# EAGLE schematic CC_Chompi_Rev4 (EAGLE 9.6.2)
Assembly variants: OG_AUDIO_BB

## Sheet 1 of 8: MCU, etc.
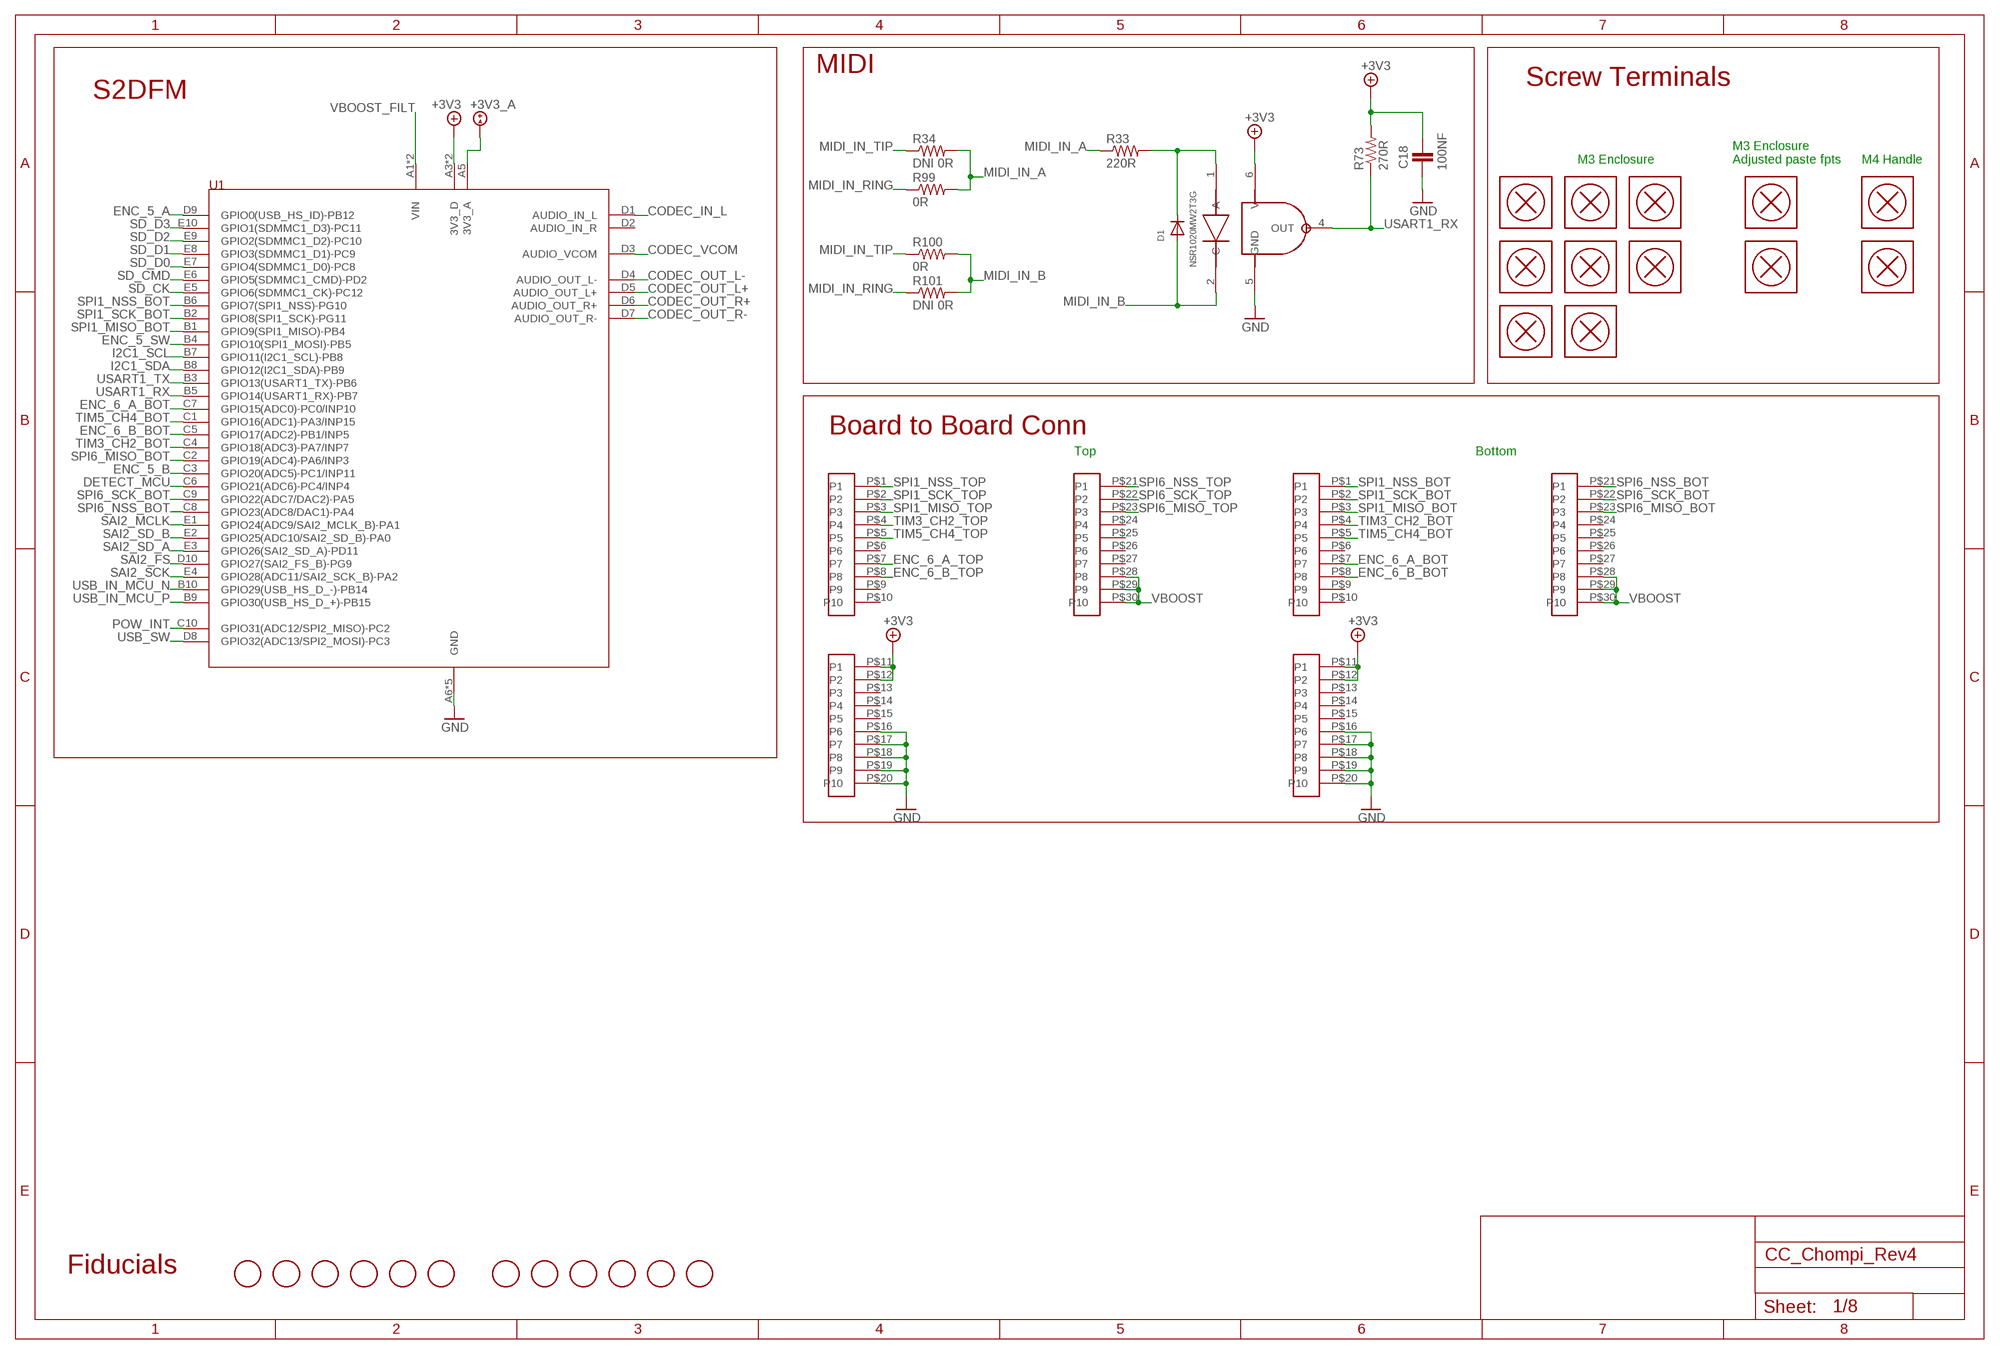
[diagram p0: schematic, sheet 1]

### Parts
C18  100NF  C-EUC0402  [C0402]
D1  NSR1020MW2T3G  DIODE_SOD-323F  [SOD-323F]
FD1  FIDUCIAL  [FIDUCIAL_1MM]
FD2  FIDUCIAL  [FIDUCIAL_1MM]
FD3  FIDUCIAL  [FIDUCIAL_1MM]
FD4  FIDUCIAL  [FIDUCIAL_1MM]
FD5  FIDUCIAL  [FIDUCIAL_1MM]
FD6  FIDUCIAL  [FIDUCIAL_1MM]
FD7  FIDUCIAL  [FIDUCIAL_1MM]
FD8  FIDUCIAL  [FIDUCIAL_1MM]
FD9  FIDUCIAL  [FIDUCIAL_1MM]
FD10  FIDUCIAL  [FIDUCIAL_1MM]
FD11  FIDUCIAL  [FIDUCIAL_1MM]
FD12  FIDUCIAL  [FIDUCIAL_1MM]
HANDLE_1  SCREW_TERMINALM4  [M4_SCREW_TERMINAL]
HANDLE_2  SCREW_TERMINALM4  [M4_SCREW_TERMINAL]
P2  ZIF-30  [FH34SRJ-30S-0-5SH-50]
P3  ZIF-30  [FH34SRJ-30S-0-5SH-50]
R33  220R  R-US_R0603  [R0603]
R34  DNI 0R  R-US_R0603  [R0603]
R73  270R  R-US_R0603  [R0603]
R99  0R  R-US_R0603  [R0603]
R100  0R  R-US_R0603  [R0603]
R101  DNI 0R  R-US_R0603  [R0603]
SCREW_1  SCREW_TERMINALM3_OLD  [T34069_OLD]
SCREW_2  SCREW_TERMINALM3_OLD  [T34069_OLD]
SCREW_3  SCREW_TERMINALM3_OLD  [T34069_OLD]
SCREW_4  SCREW_TERMINALM3_OLD  [T34069_OLD]
SCREW_5  SCREW_TERMINALM3_OLD  [T34069_OLD]
SCREW_6  SCREW_TERMINALM3_OLD_ADJ2  [T34069_OLD_ADJ2]
SCREW_7  SCREW_TERMINALM3_OLD  [T34069_OLD]
SCREW_8  SCREW_TERMINALM3_OLD_ADJ1  [T34069_OLD_ADJ1]
SCREW_9  SCREW_TERMINALM3_OLD  [T34069_OLD]
SCREW_10  SCREW_TERMINALM3_OLD  [T34069_OLD]
U1  ES_DAISY_SEED2_DFM_REV1""  [ES_DAISY_SEED2_DFM_REV1]
U6  OPTO ISOLATOR  OPTOISOLATOR_H11L1M  [DIL06_GULLWING]

### Nets
+3V3: C18.2 P2.P$11(P1) P2.P$12(P2) P3.P$11(P1) P3.P$12(P2) R73.2 U1.A3(3V3_D) U1.A4(3V3_D) U6.6(V) ; also sheet 2,3,6,7
+3V3_A: U1.A5(3V3_A) ; also sheet 3
CODEC_IN_L: U1.D1(AUDIO_IN_L) ; also sheet 8
CODEC_OUT_L+ [CODEC]: U1.D5(AUDIO_OUT_L+) ; also sheet 8
CODEC_OUT_L- [CODEC]: U1.D4(AUDIO_OUT_L-) ; also sheet 8
CODEC_OUT_R+ [CODEC]: U1.D6(AUDIO_OUT_R+) ; also sheet 8
CODEC_OUT_R- [CODEC]: U1.D7(AUDIO_OUT_R-) ; also sheet 8
CODEC_VCOM: U1.D3(AUDIO_VCOM) ; also sheet 8
DETECT_MCU: U1.C6(GPIO21(ADC6)-PC4/INP4) ; also sheet 3
ENC_5_A: U1.D9(GPIO0(USB_HS_ID)-PB12) ; also sheet 3
ENC_5_B: U1.C3(GPIO20(ADC5)-PC1/INP11) ; also sheet 3
ENC_5_SW: U1.B4(GPIO10(SPI1_MOSI)-PB5) ; also sheet 3
ENC_6_A_BOT: P3.P$7(P7) U1.C7(GPIO15(ADC0)-PC0/INP10)
ENC_6_A_TOP: P2.P$7(P7) ; also sheet 3
ENC_6_B_BOT: P3.P$8(P8) U1.C5(GPIO17(ADC2)-PB1/INP5)
ENC_6_B_TOP: P2.P$8(P8) ; also sheet 3
GND: C18.1 P2.P$16(P6) P2.P$17(P7) P2.P$18(P8) P2.P$19(P9) P2.P$20(P10) P3.P$16(P6) P3.P$17(P7) P3.P$18(P8) P3.P$19(P9) P3.P$20(P10) U1.A6(GND) U1.A7(GND) U1.A8(GND) U1.A9(GND) U1.A10(GND) U6.5(GND) ; also sheet 2,3,4,5,6,7,8
I2C1_SCL: U1.B7(GPIO11(I2C1_SCL)-PB8) ; also sheet 2
I2C1_SDA: U1.B8(GPIO12(I2C1_SDA)-PB9) ; also sheet 2
MIDI_IN_A: R33.1 R34.2 R99.2
MIDI_IN_B: D1.A R100.2 R101.2 U6.2(C)
MIDI_IN_RING: R99.1 R101.1 ; also sheet 3
MIDI_IN_TIP: R34.1 R100.1 ; also sheet 3
N$86: D1.C R33.2 U6.1(A)
POW_INT: U1.C10(GPIO31(ADC12/SPI2_MISO)-PC2) ; also sheet 2
SAI2_FS: U1.D10(GPIO27(SAI2_FS_B)-PG9) ; also sheet 7
SAI2_MCLK: U1.E1(GPIO24(ADC9/SAI2_MCLK_B)-PA1) ; also sheet 7
SAI2_SCK: U1.E4(GPIO28(ADC11/SAI2_SCK_B)-PA2) ; also sheet 7
SAI2_SD_A: U1.E3(GPIO26(SAI2_SD_A)-PD11) ; also sheet 7
SAI2_SD_B: U1.E2(GPIO25(ADC10/SAI2_SD_B)-PA0) ; also sheet 7
SD_CK: U1.E5(GPIO6(SDMMC1_CK)-PC12) ; also sheet 3
SD_CMD: U1.E6(GPIO5(SDMMC1_CMD)-PD2) ; also sheet 3
SD_D0: U1.E7(GPIO4(SDMMC1_D0)-PC8) ; also sheet 3
SD_D1: U1.E8(GPIO3(SDMMC1_D1)-PC9) ; also sheet 3
SD_D2: U1.E9(GPIO2(SDMMC1_D2)-PC10) ; also sheet 3
SD_D3: U1.E10(GPIO1(SDMMC1_D3)-PC11) ; also sheet 3
SPI1_MISO_BOT: P3.P$3(P3) U1.B1(GPIO9(SPI1_MISO)-PB4)
SPI1_MISO_TOP: P2.P$3(P3) ; also sheet 6
SPI1_NSS_BOT: P3.P$1(P1) U1.B6(GPIO7(SPI1_NSS)-PG10)
SPI1_NSS_TOP: P2.P$1(P1) ; also sheet 6
SPI1_SCK_BOT: P3.P$2(P2) U1.B2(GPIO8(SPI1_SCK)-PG11)
SPI1_SCK_TOP: P2.P$2(P2) ; also sheet 6
SPI6_MISO_BOT: P3.P$23(P3) U1.C2(GPIO19(ADC4)-PA6/INP3)
SPI6_MISO_TOP: P2.P$23(P3) ; also sheet 6
SPI6_NSS_BOT: P3.P$21(P1) U1.C8(GPIO23(ADC8/DAC1)-PA4)
SPI6_NSS_TOP: P2.P$21(P1) ; also sheet 6
SPI6_SCK_BOT: P3.P$22(P2) U1.C9(GPIO22(ADC7/DAC2)-PA5)
SPI6_SCK_TOP: P2.P$22(P2) ; also sheet 6
TIM3_CH2_BOT: P3.P$4(P4) U1.C4(GPIO18(ADC3)-PA7/INP7)
TIM3_CH2_TOP: P2.P$4(P4) ; also sheet 4
TIM5_CH4_BOT: P3.P$5(P5) U1.C1(GPIO16(ADC1)-PA3/INP15)
TIM5_CH4_TOP: P2.P$5(P5) ; also sheet 5
USART1_RX: R73.1 U1.B5(GPIO14(USART1_RX)-PB7) U6.4(OUT)
USART1_TX: U1.B3(GPIO13(USART1_TX)-PB6) ; also sheet 3
USB_IN_MCU_N: U1.B10(GPIO29(USB_HS_D_-)-PB14) ; also sheet 2
USB_IN_MCU_P: U1.B9(GPIO30(USB_HS_D_+)-PB15) ; also sheet 2
USB_SW: U1.D8(GPIO32(ADC13/SPI2_MOSI)-PC3) ; also sheet 2
VBOOST: P2.P$28(P8) P2.P$29(P9) P2.P$30(P10) P3.P$28(P8) P3.P$29(P9) P3.P$30(P10) ; also sheet 2
VBOOST_FILT: U1.A1(VIN) U1.A2(VIN) ; also sheet 2
Unconnected: P2.P$6(P6) P2.P$9(P9) P2.P$10(P10) P2.P$13(P3) P2.P$14(P4) P2.P$15(P5) P2.P$24(P4) P2.P$25(P5) P2.P$26(P6) P2.P$27(P7) P3.P$6(P6) P3.P$9(P9) P3.P$10(P10) P3.P$13(P3) P3.P$14(P4) P3.P$15(P5) P3.P$24(P4) P3.P$25(P5) P3.P$26(P6) P3.P$27(P7) U1.D2(AUDIO_IN_R)

### Notes on the sheet
- MIDI
- Screw Terminals
- S2DFM
- M3 Enclosure
- M3 Enclosure
  Adjusted paste fpts
- M4 Handle
- Board to Board Conn
- Top | Bottom
- Fiducials

## Sheet 2 of 8: Power
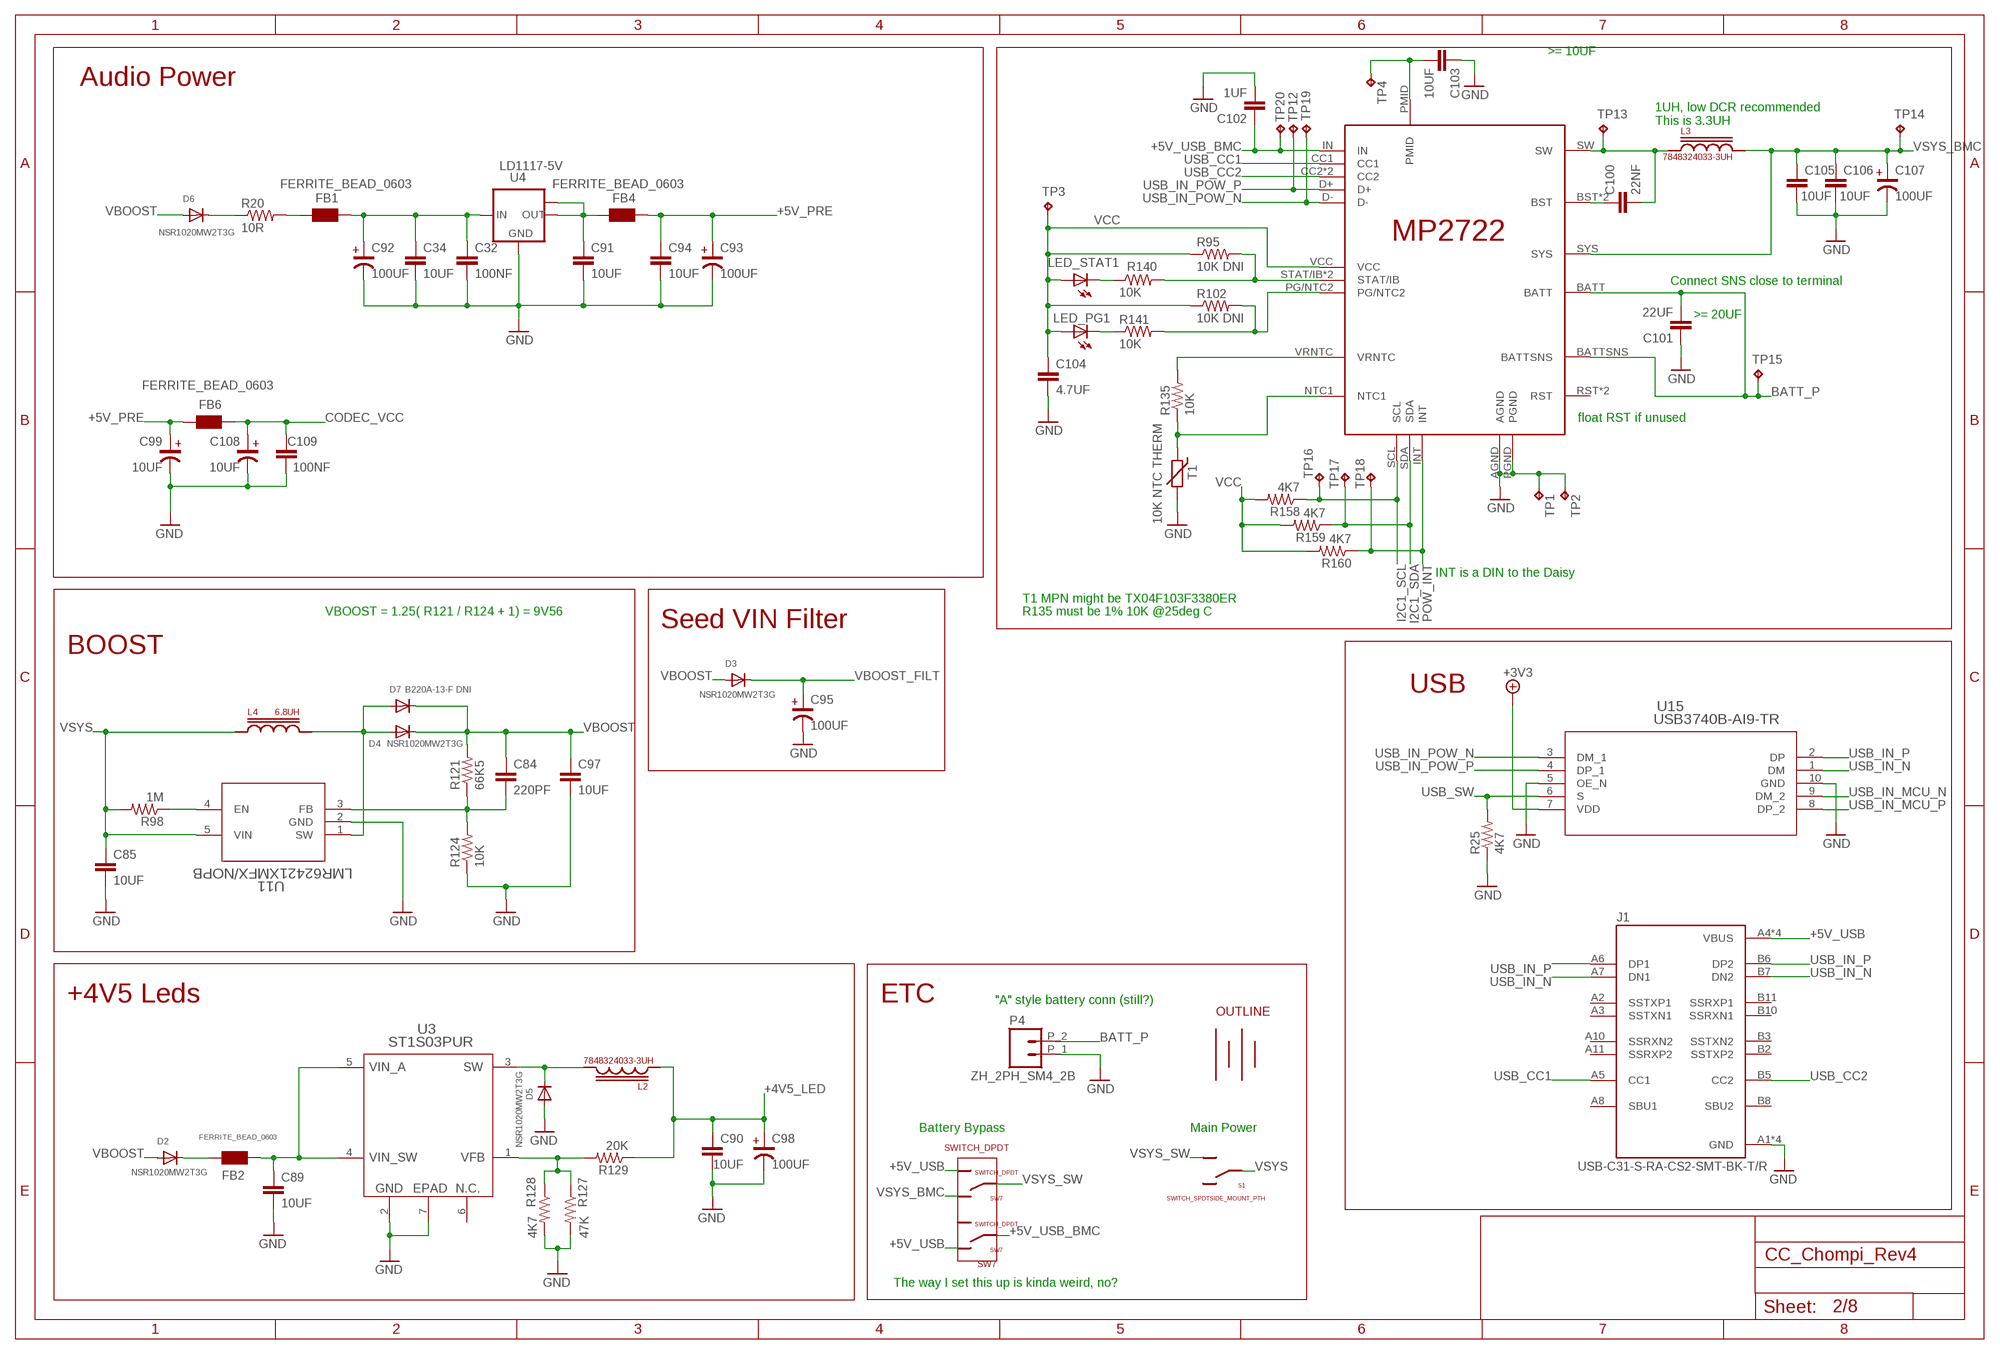
[diagram p1: schematic, sheet 2]

### Parts
C32  100NF  C-EUC0402  [C0402]  (not fitted in variant OG_AUDIO_BB)
C34  10UF  C-EUC0805  [C0805]
C84  220PF  C-EUC0603  [C0603]
C85  10UF  C-EUC0805  [C0805]
C89  10UF  C-EUC0805  [C0805]
C90  10UF  C-EUC0805  [C0805]
C91  10UF  C-EUC0805  [C0805]
C92  100UF  C-EU-POL_D  [PANASONIC_D]
C93  100UF  C-EU-POL_D  [PANASONIC_D]
C94  10UF  C-EUC0805  [C0805]
C95  100UF  C-EU-POL_D  [PANASONIC_D]
C97  10UF  C-EUC0805  [C0805]
C98  100UF  C-EU-POL_D  [PANASONIC_D]
C99  10UF  C-EU-POL_B  [PANASONIC_B]
C100  22NF  C-EUC0603  [C0603]
C101  22UF  C-EUC1206  [C1206]
C102  1UF  C-EUC0603  [C0603]
C103  10UF  C-EUC0805  [C0805]
C104  4.7UF  C-EUC0603  [C0603]
C105  10UF  C-EUC0805  [C0805]
C106  10UF  C-EUC0805  [C0805]
C107  100UF  C-EU-POL_D  [PANASONIC_D]
C108  10UF  C-EU-POL_B  [PANASONIC_B]
C109  100NF  C-EUC0402  [C0402]
D2  NSR1020MW2T3G  DIODE_SOD-323F  [SOD-323F]
D3  NSR1020MW2T3G  DIODE_SOD-323F  [SOD-323F]
D4  NSR1020MW2T3G  DIODE_SOD-323F  [SOD-323F]
D5  NSR1020MW2T3G  DIODE_SOD-323F  [SOD-323F]
D6  NSR1020MW2T3G  DIODE_SOD-323F  [SOD-323F]
D7  B220A-13-F DNI  DIODE_SMA  [SMADIODE]
FB1  FERRITE_BEAD_0603  [WUERTH-ELEKTRONIK_0603]
FB2  FERRITE_BEAD_0603  [WUERTH-ELEKTRONIK_0603]  (not fitted in variant OG_AUDIO_BB)
FB4  FERRITE_BEAD_0603  [WUERTH-ELEKTRONIK_0603]
FB6  FERRITE_BEAD_0603  [WUERTH-ELEKTRONIK_0603]
J1  USB-C31-S-RA-CS2-SMT-BK-T/R  [ADAM_USB-C31-S-RA-CS2-SMT-BK-T/R]
L2  7848324033-3UH  INDUCTOR1008  [I1008]
L3  7848324033-3UH  INDUCTOR1008  [I1008]
L4  6.8UH  INDUCTOR_MPL-SE6040  [MPL-SE6040]
LED_PG1  LED_RED_0603  [DIODE_0603]
LED_STAT1  LED_RED_0603  [DIODE_0603]
P4  ZH_2PH_SM4_2B  [S2B-PH-SM4-TB(LF)(SN)]
R20  10R  R-US_R0603  [R0603]
R25  4K7  R-US_R0603  [R0603]
R95  10K DNI  R-US_R0603  [R0603]
R98  1M  R-US_R0603  [R0603]
R102  10K DNI  R-US_R0603  [R0603]
R121  66K5  R-US_R0603  [R0603]
R124  10K  R-US_R0603  [R0603]
R127  47K  R-US_R0603  [R0603]
R128  4K7  R-US_R0603  [R0603]
R129  20K  R-US_R0603  [R0603]
R135  10K  R-US_R0603  [R0603]
R140  10K  R-US_R0603  [R0603]
R141  10K  R-US_R0603  [R0603]
R158  4K7  R-US_R0603  [R0603]
R159  4K7  R-US_R0603  [R0603]
R160  4K7  R-US_R0603  [R0603]
S1  SWITCH_SPDTSIDE_MOUNT_PTH  [SK-12F17-G7]
SW7  SWITCH_DPDT  [MSS6-V-T/R]
T1  10K NTC THERM  THERMISTOR  [R0603]
TP1  TPTP20R  [TP20R]
TP2  TPTP20R  [TP20R]
TP3  TPTP20R  [TP20R]
TP4  TPTP13R  [TP13R]
TP12  TPTP20R  [TP20R]
TP13  TPTP20R  [TP20R]
TP14  TPTP20R  [TP20R]
TP15  TPTP20R  [TP20R]
TP16  TPTP20R  [TP20R]
TP17  TPTP20R  [TP20R]
TP18  TPTP20R  [TP20R]
TP19  TPTP20R  [TP20R]
TP20  TPTP20R  [TP20R]
U3  ST1S03PUR  [DFN06_3X3_STM]
U4  LD1117-5V  [SOT223]
U11  LMR62421XMFX/NOPB  [MF05A]
U13  MP2722 Buck Charger  MP2722_BUCK_CHARGER  [MP2722]
U15  USB3740B-AI9-TR  [QFN10_1P6X2P1MC_MCH]
U$1  LP346384  [LP346384]

### Nets
+3V3: U15.7(VDD) ; also sheet 1,3,6,7
+4V5_LED: C90.1 C98.+(POS) L2.2 R129.1 ; also sheet 4,5
+5V_PRE: C93.+(POS) C94.1 C99.+(POS) FB4.2 FB6.2
+5V_USB: J1.A4(VBUS) J1.A9(VBUS) J1.B4(VBUS) J1.B9(VBUS) SW7.A(T1.1) SW7.F(T2.2)
+5V_USB_BMC: C102.1 SW7.B(P1) TP20.TP U13.IN
BATT_P: C101.2 P4.P_2 TP15.TP U13.BATT U13.BATTSNS
BATT_THERM: R135.1 T1.1 U13.NTC1
CODEC_VCC: C108.+(POS) C109.1 FB6.1 ; also sheet 7,8
GND: C32.2 C34.2 C85.2 C89.2 C90.2 C91.2 C92.-(NEG) C93.-(NEG) C94.2 C95.-(NEG) C97.2 C98.-(NEG) C99.-(NEG) C101.1 C102.2 C103.1 C104.2 C105.2 C106.2 C107.-(NEG) C108.-(NEG) C109.2 D5.A J1.A1(GND) J1.A12(GND) J1.B1(GND) J1.B12(GND) P4.P_1 R25.1 R124.1 R127.2 R128.2 T1.2 TP1.TP TP2.TP U3.2(GND) U3.7(EPAD) U4.1(GND) U11.2(GND) U13.AGND U13.PGND U15.5(OE_N) U15.10(GND) ; also sheet 1,3,4,5,6,7,8
I2C1_SCL: R158.1 TP16.TP U13.SCL ; also sheet 1
I2C1_SDA: R159.1 TP17.TP U13.SDA ; also sheet 1
N$17: C100.1 U13.BST U13.BST_2(BST)
N$32: D2.C FB2.1
N$34: R135.2 U13.VRNTC
N$35: FB1.1 R20.2
N$44: D6.C R20.1
N$65: C32.1 C34.1 C92.+(POS) FB1.2 U4.3(IN)
N$69: C84.2 R121.1 R124.2 U11.3(FB)
N$110: LED_STAT1.CATHODE(C) R140.1
N$111: LED_PG1.CATHODE(C) R141.1
N$112: D4.A D7.A L4.P$2 U11.1(SW)
N$114: C89.1 FB2.2 U3.4(VIN_SW) U3.5(VIN_A)
N$121: R127.1 R128.1 R129.2 U3.1(VFB)
N$122: D5.C L2.1 U3.3(SW)
N$126: R98.1 U11.4(EN)
PG: R102.2 R141.2 U13.PG/NTC2
PMID: C103.2 TP4.TP U13.PMID
POW_INT: R160.1 TP18.TP U13.INT ; also sheet 1
STAT: R95.2 R140.2 U13.STAT/IB U13.STAT/IB_2(STAT/IB)
SW: C100.2 L3.2 TP13.TP U13.SW
USB_CC1: J1.A5(CC1) U13.CC1
USB_CC2: J1.B5(CC2) U13.CC2 U13.CC2_2(CC2)
USB_IN_MCU_N: U15.9(DM_2) ; also sheet 1
USB_IN_MCU_P: U15.8(DP_2) ; also sheet 1
USB_IN_N: J1.A7(DN1) J1.B7(DN2) U15.1(DM)
USB_IN_P: J1.A6(DP1) J1.B6(DP2) U15.2(DP)
USB_IN_POW_N: TP19.TP U13.D- U15.3(DM_1)
USB_IN_POW_P: TP12.TP U13.D+ U15.4(DP_1)
USB_SW: R25.2 U15.6(S) ; also sheet 1
V_REG_2: C91.1 FB4.1 U4.2(OUT) U4.TAB(OUT1)
VBOOST: C84.1 C97.1 D2.A D3.A D4.C D6.A D7.C R121.2 ; also sheet 1
VBOOST_FILT: C95.+(POS) D3.C ; also sheet 1
VCC: C104.1 LED_PG1.ANODE(A) LED_STAT1.ANODE(A) R95.1 R102.1 R158.2 R159.2 R160.2 TP3.TP U13.VCC
VSYS: C85.1 L4.P$1 R98.2 S1.P$1(P) U11.5(VIN)
VSYS_BMC: C105.1 C106.1 C107.+(POS) L3.1 SW7.D(T2.1) TP14.TP U13.SYS
VSYS_SW: S1.P$2(T0) SW7.E(P2)
Unconnected: J1.A2(SSTXP1) J1.A3(SSTXN1) J1.A8(SBU1) J1.A10(SSRXN2) J1.A11(SSRXP2) J1.B2(SSTXP2) J1.B3(SSTXN2) J1.B8(SBU2) J1.B10(SSRXN1) J1.B11(SSRXP1) S1.P$3(T1) SW7.C(T1.2) U3.6(N.C.) U13.RST U13.RST_2(RST)

### Notes on the sheet
- >= 10UF
- Audio Power
- 1UH, low DCR recommended
  This is 3.3UH
- Connect SNS close to terminal
- >= 20UF
- float RST if unused
- INT is a DIN to the Daisy
- T1 MPN might be TX04F103F3380ER
- VBOOST = 1.25( R121 / R124 + 1) = 9V56 | R135 must be 1% 10K @25deg C
- Seed VIN Filter
- BOOST
- USB
- +4V5 Leds | ETC | "A" style battery conn (still?)
- Battery Bypass | Main Power
- The way I set this up is kinda weird, no?

## Sheet 3 of 8: Interface
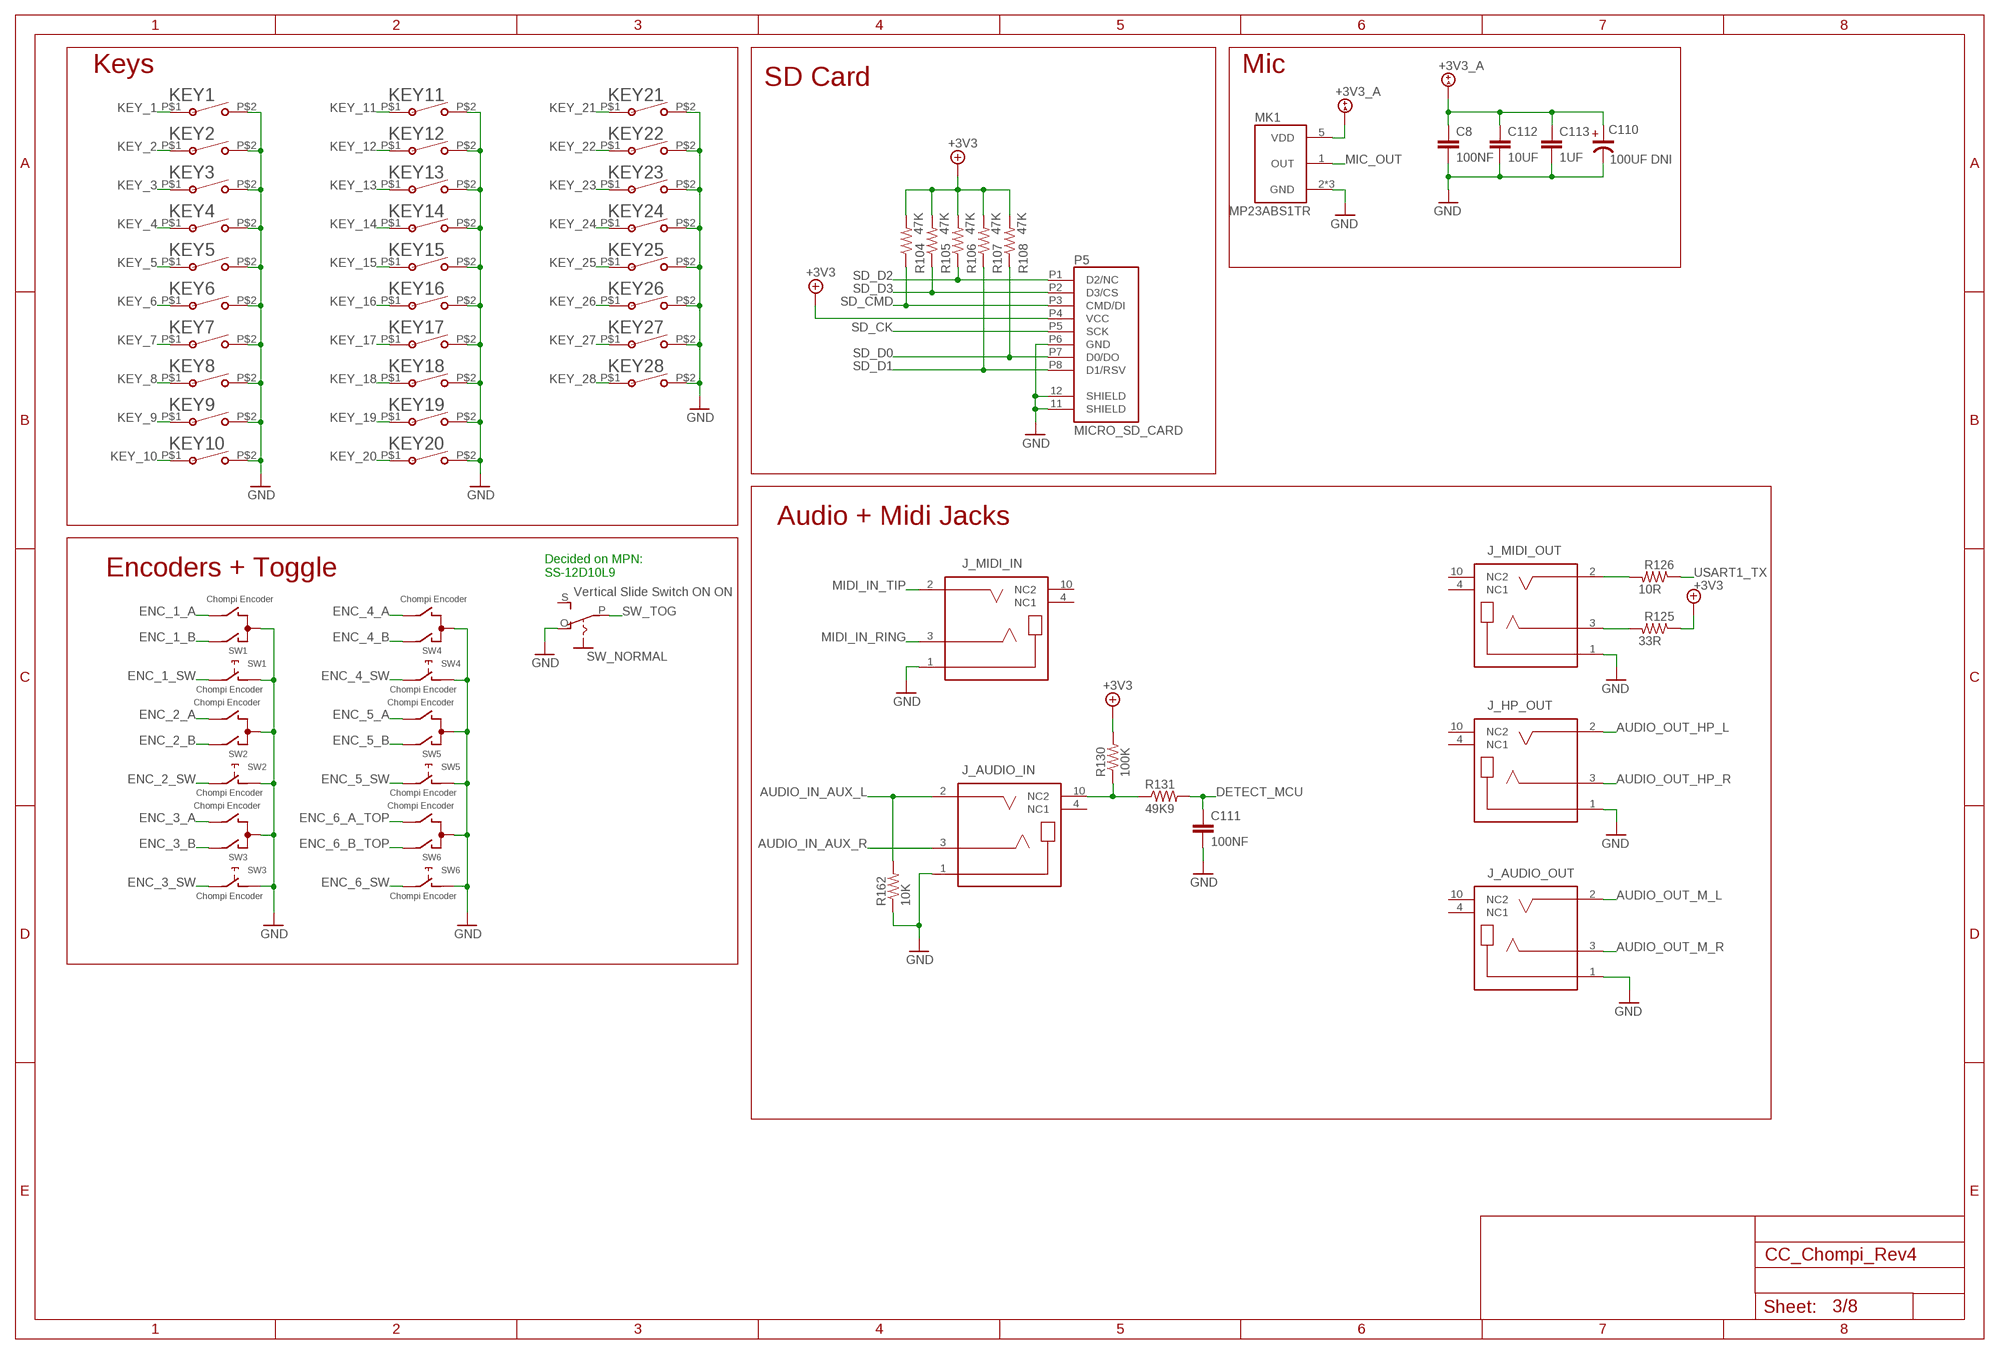
[diagram p2: schematic, sheet 3]

### Parts
C8  100NF  C-EUC0402  [C0402]
C110  100UF DNI  C-EU-POL_D  [PANASONIC_D]
C111  100NF  C-EUC0402  [C0402]
C112  10UF  C-EUC0805  [C0805]
C113  1UF  C-EUC0603  [C0603]
J_AUDIO_IN  PJ-3062-HD-R  SJ2_TRS_JACK  [CUI_SJ2-35863B1-SMT-TR]
J_AUDIO_OUT  PJ-3062-HD-B  SJ2_TRS_JACK  [CUI_SJ2-35863B1-SMT-TR]
J_HP_OUT  PJ-3062-G  SJ2_TRS_JACK  [CUI_SJ2-35863B1-SMT-TR]
J_MIDI_IN  PJ-3062-HD-B  SJ2_TRS_JACK  [CUI_SJ2-35863B1-SMT-TR]
J_MIDI_OUT  PJ-3062-HD-B  SJ2_TRS_JACK  [CUI_SJ2-35863B1-SMT-TR]
KEY1  MX3A-L1NB_SOCKET  [CPG151101S11]
KEY2  MX3A-L1NB_SOCKET  [CPG151101S11]
KEY3  MX3A-L1NB_SOCKET  [CPG151101S11]
KEY4  MX3A-L1NB_SOCKET  [CPG151101S11]
KEY5  MX3A-L1NB_SOCKET  [CPG151101S11]
KEY6  MX3A-L1NB_SOCKET  [CPG151101S11]
KEY7  MX3A-L1NB_SOCKET  [CPG151101S11]
KEY8  MX3A-L1NB_SOCKET  [CPG151101S11]
KEY9  MX3A-L1NB_SOCKET  [CPG151101S11]
KEY10  MX3A-L1NB_SOCKET  [CPG151101S11]
KEY11  MX3A-L1NB_SOCKET  [CPG151101S11]
KEY12  MX3A-L1NB_SOCKET  [CPG151101S11]
KEY13  MX3A-L1NB_SOCKET  [CPG151101S11]
KEY14  MX3A-L1NB_SOCKET  [CPG151101S11]
KEY15  MX3A-L1NB_SOCKET  [CPG151101S11]
KEY16  MX3A-L1NB_SOCKET  [CPG151101S11]
KEY17  MX3A-L1NB_SOCKET  [CPG151101S11]
KEY18  MX3A-L1NB_SOCKET  [CPG151101S11]
KEY19  MX3A-L1NB_SOCKET  [CPG151101S11]
KEY20  MX3A-L1NB_SOCKET  [CPG151101S11]
KEY21  MX3A-L1NB_SOCKET  [CPG151101S11]
KEY22  MX3A-L1NB_SOCKET  [CPG151101S11]
KEY23  MX3A-L1NB_SOCKET  [CPG151101S11]
KEY24  MX3A-L1NB_SOCKET  [CPG151101S11]
KEY25  MX3A-L1NB_SOCKET  [CPG151101S11]
KEY26  MX3A-L1NB_SOCKET  [CPG151101S11]
KEY27  MX3A-L1NB_SOCKET  [CPG151101S11]
KEY28  MX3A-L1NB_SOCKET  [CPG151101S11]
MK1  MP23ABS1TR  [MIC_MP23ABS1TR]
P5  MICRO_SD_CARD  [MEM2061-01-188-00-A_GCT]
R104  47K  R-US_R0603  [R0603]
R105  47K  R-US_R0603  [R0603]
R106  47K  R-US_R0603  [R0603]
R107  47K  R-US_R0603  [R0603]
R108  47K  R-US_R0603  [R0603]
R125  33R  R-US_R0603  [R0603]
R126  10R  R-US_R0603  [R0603]
R130  100K  R-US_R0402  [R0402]
R131  49K9  R-US_R0603  [R0603]
R162  10K  R-US_R0603  [R0603]
SW1  Chompi Encoder  ENCODER_SMOOTH_SILK  [PEC11_SILK]
SW2  Chompi Encoder  ENCODER_SMOOTH_SILK  [PEC11_SILK]
SW3  Chompi Encoder  ENCODER_SMOOTH_SILK  [PEC11_SILK]
SW4  Chompi Encoder  ENCODER_SMOOTH_SILK  [PEC11_SILK]
SW5  Chompi Encoder  ENCODER_SMOOTH_SILK  [PEC11_SILK]
SW6  Chompi Encoder  ENCODER_SMOOTH_SILK  [PEC11_SILK]
SW_NORMAL  Vertical Slide Switch ON ON  S-ON-ONSMALL_SLIDE  [ES_100SP1T6B11M2QEH_SMALL]

### Nets
+3V3: P5.P4(VCC) R104.2 R105.2 R106.2 R107.2 R108.2 R125.1 R130.2 ; also sheet 1,2,6,7
+3V3_A: C8.1 C110.+(POS) C112.1 C113.1 MK1.5(VDD) ; also sheet 1
AUDIO_IN_AUX_L: J_AUDIO_IN.2(TIP) R162.2 ; also sheet 7
AUDIO_IN_AUX_R: J_AUDIO_IN.3(RING) ; also sheet 7
AUDIO_OUT_HP_L: J_HP_OUT.2(TIP) ; also sheet 8
AUDIO_OUT_HP_R: J_HP_OUT.3(RING) ; also sheet 8
AUDIO_OUT_M_L: J_AUDIO_OUT.2(TIP) ; also sheet 7
AUDIO_OUT_M_R: J_AUDIO_OUT.3(RING) ; also sheet 7
DETECT: J_AUDIO_IN.10(NC2) R130.1 R131.1
DETECT_MCU: C111.1 R131.2 ; also sheet 1
ENC_1_A: SW1.B ; also sheet 6
ENC_1_B: SW1.A ; also sheet 6
ENC_1_SW: SW1.E ; also sheet 6
ENC_2_A: SW2.B ; also sheet 6
ENC_2_B: SW2.A ; also sheet 6
ENC_2_SW: SW2.E ; also sheet 6
ENC_3_A: SW3.B ; also sheet 6
ENC_3_B: SW3.A ; also sheet 6
ENC_3_SW: SW3.E ; also sheet 6
ENC_4_A: SW4.B ; also sheet 6
ENC_4_B: SW4.A ; also sheet 6
ENC_4_SW: SW4.E ; also sheet 6
ENC_5_A: SW5.B ; also sheet 1
ENC_5_B: SW5.A ; also sheet 1
ENC_5_SW: SW5.E ; also sheet 1
ENC_6_A_TOP: SW6.B ; also sheet 1
ENC_6_B_TOP: SW6.A ; also sheet 1
ENC_6_SW: SW6.E ; also sheet 6
GND: C8.2 C110.-(NEG) C111.2 C112.2 C113.2 J_AUDIO_IN.1(SLEEVE) J_AUDIO_OUT.1(SLEEVE) J_HP_OUT.1(SLEEVE) J_MIDI_IN.1(SLEEVE) J_MIDI_OUT.1(SLEEVE) KEY1.P$2 KEY2.P$2 KEY3.P$2 KEY4.P$2 KEY5.P$2 KEY6.P$2 KEY7.P$2 KEY8.P$2 KEY9.P$2 KEY10.P$2 KEY11.P$2 KEY12.P$2 KEY13.P$2 KEY14.P$2 KEY15.P$2 KEY16.P$2 KEY17.P$2 KEY18.P$2 KEY19.P$2 KEY20.P$2 KEY21.P$2 KEY22.P$2 KEY23.P$2 KEY24.P$2 KEY25.P$2 KEY26.P$2 KEY27.P$2 KEY28.P$2 MK1.2(GND) MK1.3(GND) MK1.4(GND) P5.11(SHIELD) P5.12(SHIELD) P5.P6(GND) R162.1 SW1.C SW1.D SW2.C SW2.D SW3.C SW3.D SW4.C SW4.D SW5.C SW5.D SW6.C SW6.D SW_NORMAL.O ; also sheet 1,2,4,5,6,7,8
KEY_1: KEY1.P$1 ; also sheet 6
KEY_2: KEY2.P$1 ; also sheet 6
KEY_3: KEY3.P$1 ; also sheet 6
KEY_4: KEY4.P$1 ; also sheet 6
KEY_5: KEY5.P$1 ; also sheet 6
KEY_6: KEY6.P$1 ; also sheet 6
KEY_7: KEY7.P$1 ; also sheet 6
KEY_8: KEY8.P$1 ; also sheet 6
KEY_9: KEY9.P$1 ; also sheet 6
KEY_10: KEY10.P$1 ; also sheet 6
KEY_11: KEY11.P$1 ; also sheet 6
KEY_12: KEY12.P$1 ; also sheet 6
KEY_13: KEY13.P$1 ; also sheet 6
KEY_14: KEY14.P$1 ; also sheet 6
KEY_15: KEY15.P$1 ; also sheet 6
KEY_16: KEY16.P$1 ; also sheet 6
KEY_17: KEY17.P$1 ; also sheet 6
KEY_18: KEY18.P$1 ; also sheet 6
KEY_19: KEY19.P$1 ; also sheet 6
KEY_20: KEY20.P$1 ; also sheet 6
KEY_21: KEY21.P$1 ; also sheet 6
KEY_22: KEY22.P$1 ; also sheet 6
KEY_23: KEY23.P$1 ; also sheet 6
KEY_24: KEY24.P$1 ; also sheet 6
KEY_25: KEY25.P$1 ; also sheet 6
KEY_26: KEY26.P$1 ; also sheet 6
KEY_27: KEY27.P$1 ; also sheet 6
KEY_28: KEY28.P$1 ; also sheet 6
MIC_OUT: MK1.1(OUT) ; also sheet 8
MIDI_IN_RING: J_MIDI_IN.3(RING) ; also sheet 1
MIDI_IN_TIP: J_MIDI_IN.2(TIP) ; also sheet 1
N$123: J_MIDI_OUT.3(RING) R125.2
N$124: J_MIDI_OUT.2(TIP) R126.2
SD_CK: P5.P5(SCK) ; also sheet 1
SD_CMD: P5.P3(CMD/DI) R104.1 ; also sheet 1
SD_D0: P5.P7(D0/DO) R108.1 ; also sheet 1
SD_D1: P5.P8(D1/RSV) R107.1 ; also sheet 1
SD_D2: P5.P1(D2/NC) R106.1 ; also sheet 1
SD_D3: P5.P2(D3/CS) R105.1 ; also sheet 1
SW_TOG: SW_NORMAL.P ; also sheet 6
USART1_TX: R126.1 ; also sheet 1
Unconnected: J_AUDIO_IN.4(NC1) J_AUDIO_OUT.4(NC1) J_AUDIO_OUT.10(NC2) J_HP_OUT.4(NC1) J_HP_OUT.10(NC2) J_MIDI_IN.4(NC1) J_MIDI_IN.10(NC2) J_MIDI_OUT.4(NC1) J_MIDI_OUT.10(NC2) SW1.GND1(G) SW1.GND2(G) SW2.GND1(G) SW2.GND2(G) SW3.GND1(G) SW3.GND2(G) SW4.GND1(G) SW4.GND2(G) SW5.GND1(G) SW5.GND2(G) SW6.GND1(G) SW6.GND2(G) SW_NORMAL.S

### Notes on the sheet
- Keys | Mic
- SD Card
- Audio + Midi Jacks
- Encoders + Toggle
- Decided on MPN:
  SS-12D10L9

## Sheet 4 of 8: Keyboard Leds
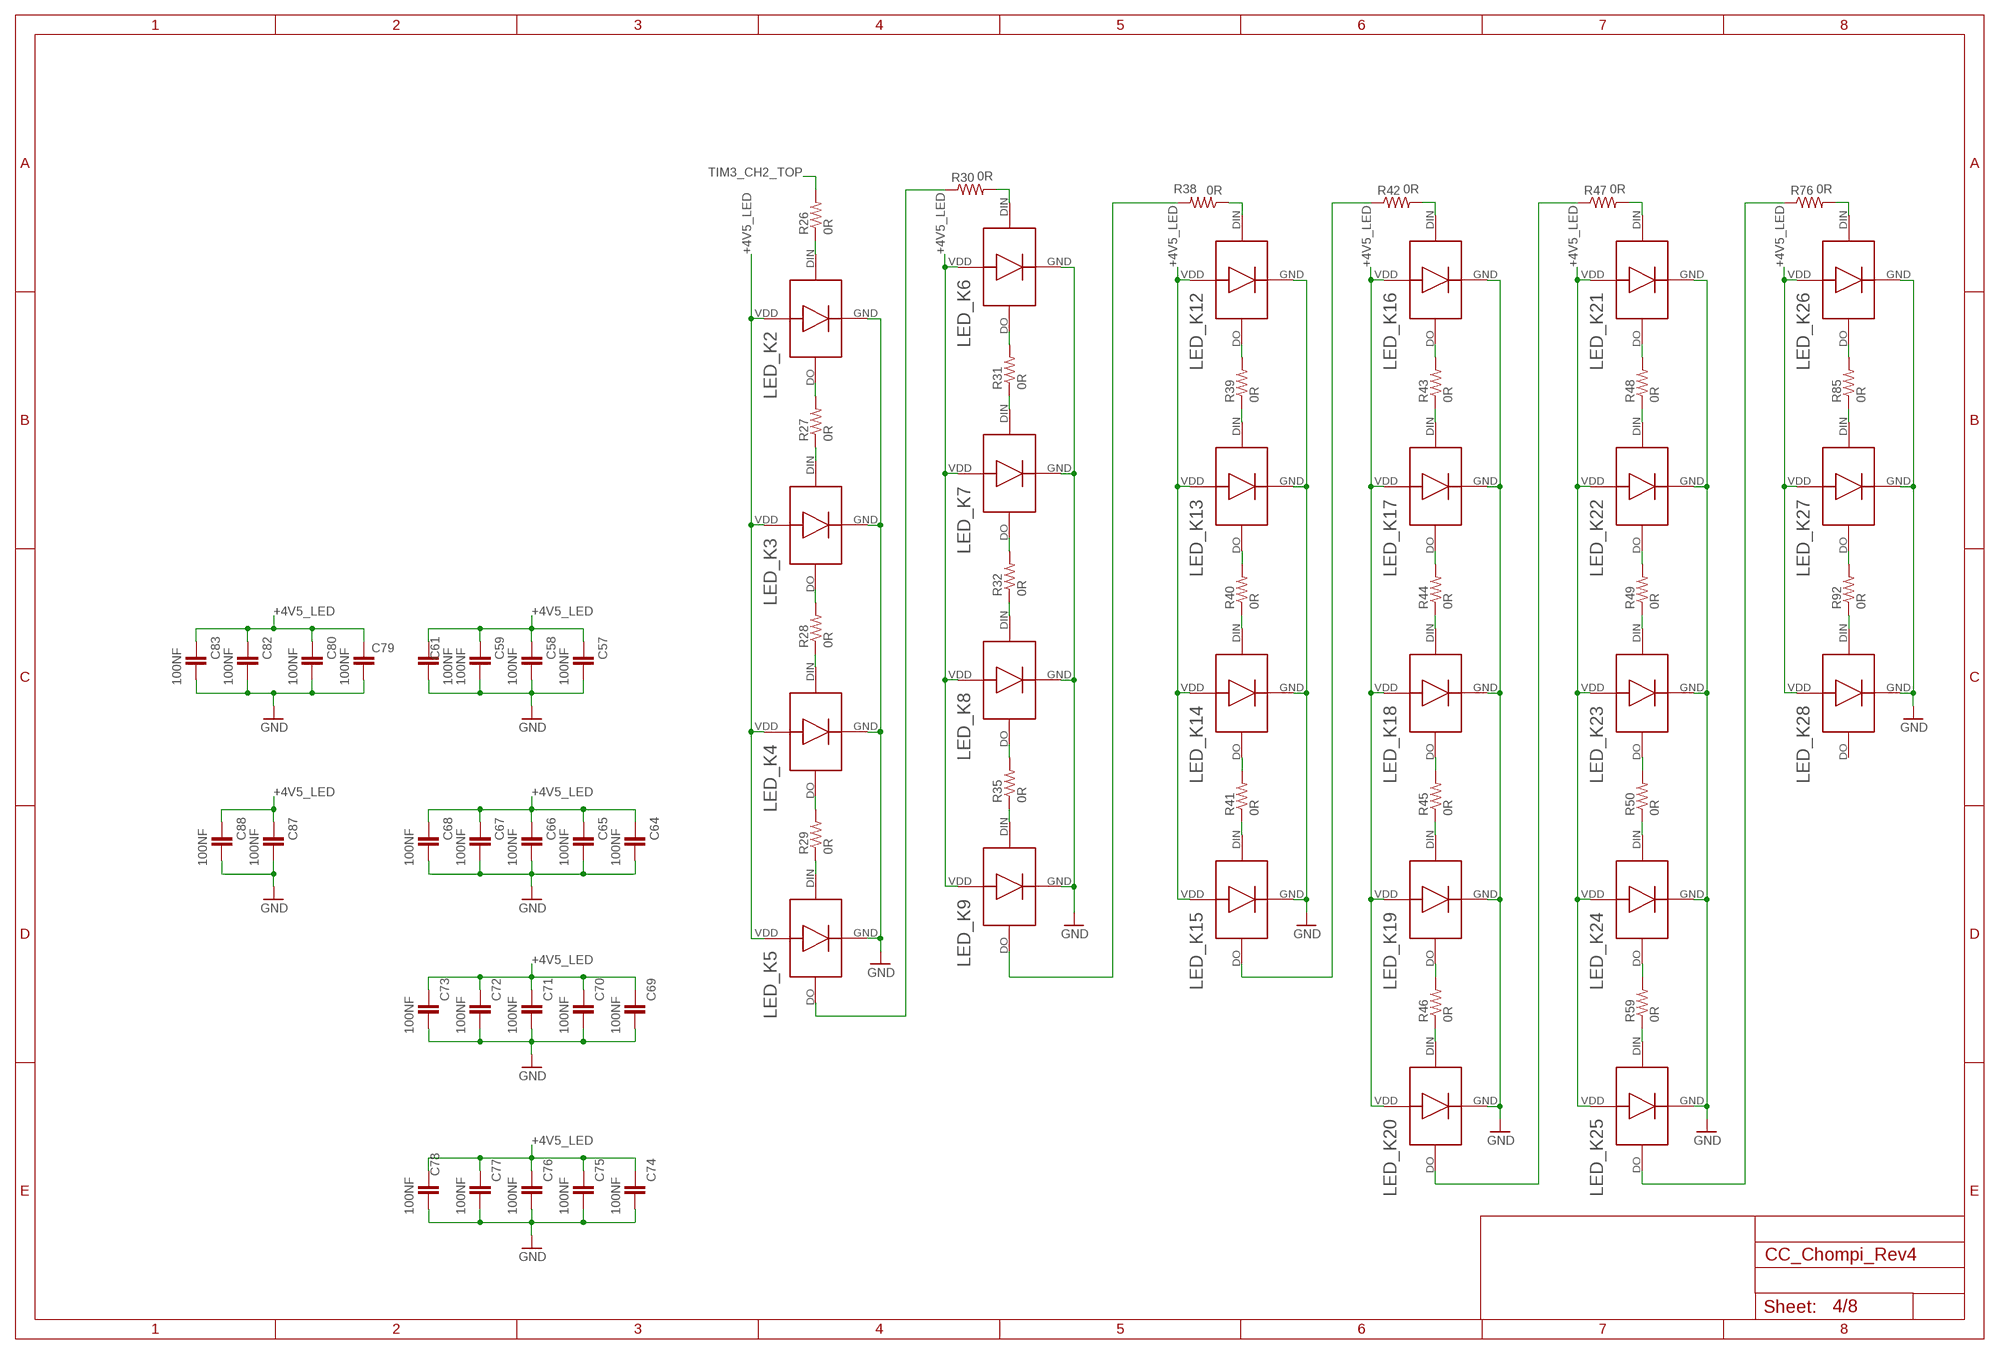
[diagram p3: schematic, sheet 4]

### Parts
C57  100NF  C-EUC0402  [C0402]
C58  100NF  C-EUC0402  [C0402]
C59  100NF  C-EUC0402  [C0402]
C61  100NF  C-EUC0402  [C0402]
C64  100NF  C-EUC0402  [C0402]
C65  100NF  C-EUC0402  [C0402]
C66  100NF  C-EUC0402  [C0402]
C67  100NF  C-EUC0402  [C0402]
C68  100NF  C-EUC0402  [C0402]
C69  100NF  C-EUC0402  [C0402]
C70  100NF  C-EUC0402  [C0402]
C71  100NF  C-EUC0402  [C0402]
C72  100NF  C-EUC0402  [C0402]
C73  100NF  C-EUC0402  [C0402]
C74  100NF  C-EUC0402  [C0402]
C75  100NF  C-EUC0402  [C0402]
C76  100NF  C-EUC0402  [C0402]
C77  100NF  C-EUC0402  [C0402]
C78  100NF  C-EUC0402  [C0402]
C79  100NF  C-EUC0402  [C0402]
C80  100NF  C-EUC0402  [C0402]
C82  100NF  C-EUC0402  [C0402]
C83  100NF  C-EUC0402  [C0402]
C87  100NF  C-EUC0402  [C0402]
C88  100NF  C-EUC0402  [C0402]
LED_K2  Digital LED Reverse Mount  DIGITAL_LEDREV_MOUNT  [IN-PI32TAR]
LED_K3  Digital LED Reverse Mount  DIGITAL_LEDREV_MOUNT  [IN-PI32TAR]
LED_K4  Digital LED Reverse Mount  DIGITAL_LEDREV_MOUNT  [IN-PI32TAR]
LED_K5  Digital LED Reverse Mount  DIGITAL_LEDREV_MOUNT  [IN-PI32TAR]
LED_K6  Digital LED Reverse Mount  DIGITAL_LEDREV_MOUNT  [IN-PI32TAR]
LED_K7  Digital LED Reverse Mount  DIGITAL_LEDREV_MOUNT  [IN-PI32TAR]
LED_K8  Digital LED Reverse Mount  DIGITAL_LEDREV_MOUNT  [IN-PI32TAR]
LED_K9  Digital LED Reverse Mount  DIGITAL_LEDREV_MOUNT  [IN-PI32TAR]
LED_K12  Digital LED Reverse Mount  DIGITAL_LEDREV_MOUNT  [IN-PI32TAR]
LED_K13  Digital LED Reverse Mount  DIGITAL_LEDREV_MOUNT  [IN-PI32TAR]
LED_K14  Digital LED Reverse Mount  DIGITAL_LEDREV_MOUNT  [IN-PI32TAR]
LED_K15  Digital LED Reverse Mount  DIGITAL_LEDREV_MOUNT  [IN-PI32TAR]
LED_K16  Digital LED Reverse Mount  DIGITAL_LEDREV_MOUNT  [IN-PI32TAR]
LED_K17  Digital LED Reverse Mount  DIGITAL_LEDREV_MOUNT  [IN-PI32TAR]
LED_K18  Digital LED Reverse Mount  DIGITAL_LEDREV_MOUNT  [IN-PI32TAR]
LED_K19  Digital LED Reverse Mount  DIGITAL_LEDREV_MOUNT  [IN-PI32TAR]
LED_K20  Digital LED Reverse Mount  DIGITAL_LEDREV_MOUNT  [IN-PI32TAR]
LED_K21  Digital LED Reverse Mount  DIGITAL_LEDREV_MOUNT  [IN-PI32TAR]
LED_K22  Digital LED Reverse Mount  DIGITAL_LEDREV_MOUNT  [IN-PI32TAR]
LED_K23  Digital LED Reverse Mount  DIGITAL_LEDREV_MOUNT  [IN-PI32TAR]
LED_K24  Digital LED Reverse Mount  DIGITAL_LEDREV_MOUNT  [IN-PI32TAR]
LED_K25  Digital LED Reverse Mount  DIGITAL_LEDREV_MOUNT  [IN-PI32TAR]
LED_K26  Digital LED Reverse Mount  DIGITAL_LEDREV_MOUNT  [IN-PI32TAR]
LED_K27  Digital LED Reverse Mount  DIGITAL_LEDREV_MOUNT  [IN-PI32TAR]
LED_K28  Digital LED Reverse Mount  DIGITAL_LEDREV_MOUNT  [IN-PI32TAR]
R26  0R  R-US_R0603  [R0603]
R27  0R  R-US_R0603  [R0603]
R28  0R  R-US_R0603  [R0603]
R29  0R  R-US_R0603  [R0603]
R30  0R  R-US_R0603  [R0603]
R31  0R  R-US_R0603  [R0603]
R32  0R  R-US_R0603  [R0603]
R35  0R  R-US_R0603  [R0603]
R38  0R  R-US_R0603  [R0603]
R39  0R  R-US_R0603  [R0603]
R40  0R  R-US_R0603  [R0603]
R41  0R  R-US_R0603  [R0603]
R42  0R  R-US_R0603  [R0603]
R43  0R  R-US_R0603  [R0603]
R44  0R  R-US_R0603  [R0603]
R45  0R  R-US_R0603  [R0603]
R46  0R  R-US_R0603  [R0603]
R47  0R  R-US_R0603  [R0603]
R48  0R  R-US_R0603  [R0603]
R49  0R  R-US_R0603  [R0603]
R50  0R  R-US_R0603  [R0603]
R59  0R  R-US_R0603  [R0603]
R76  0R  R-US_R0603  [R0603]
R85  0R  R-US_R0603  [R0603]
R92  0R  R-US_R0603  [R0603]

### Nets
+4V5_LED: C57.1 C58.1 C59.1 C61.1 C64.1 C65.1 C66.1 C67.1 C68.1 C69.1 C70.1 C71.1 C72.1 C73.1 C74.1 C75.1 C76.1 C77.1 C78.1 C79.1 C80.1 C82.1 C83.1 C87.1 C88.1 LED_K2.VDD LED_K3.VDD LED_K4.VDD LED_K5.VDD LED_K6.VDD LED_K7.VDD LED_K8.VDD LED_K9.VDD LED_K12.VDD LED_K13.VDD LED_K14.VDD LED_K15.VDD LED_K16.VDD LED_K17.VDD LED_K18.VDD LED_K19.VDD LED_K20.VDD LED_K21.VDD LED_K22.VDD LED_K23.VDD LED_K24.VDD LED_K25.VDD LED_K26.VDD LED_K27.VDD LED_K28.VDD ; also sheet 2,5
GND: C57.2 C58.2 C59.2 C61.2 C64.2 C65.2 C66.2 C67.2 C68.2 C69.2 C70.2 C71.2 C72.2 C73.2 C74.2 C75.2 C76.2 C77.2 C78.2 C79.2 C80.2 C82.2 C83.2 C87.2 C88.2 LED_K2.GND(VSS) LED_K3.GND(VSS) LED_K4.GND(VSS) LED_K5.GND(VSS) LED_K6.GND(VSS) LED_K7.GND(VSS) LED_K8.GND(VSS) LED_K9.GND(VSS) LED_K12.GND(VSS) LED_K13.GND(VSS) LED_K14.GND(VSS) LED_K15.GND(VSS) LED_K16.GND(VSS) LED_K17.GND(VSS) LED_K18.GND(VSS) LED_K19.GND(VSS) LED_K20.GND(VSS) LED_K21.GND(VSS) LED_K22.GND(VSS) LED_K23.GND(VSS) LED_K24.GND(VSS) LED_K25.GND(VSS) LED_K26.GND(VSS) LED_K27.GND(VSS) LED_K28.GND(VSS) ; also sheet 1,2,3,5,6,7,8
N$33: LED_K5.DO R30.1
N$36: LED_K2.DIN(DI) R26.1
N$37: LED_K2.DO R27.2
N$38: LED_K3.DIN(DI) R27.1
N$39: LED_K3.DO R28.2
N$40: LED_K4.DIN(DI) R28.1
N$41: LED_K4.DO R29.2
N$42: LED_K5.DIN(DI) R29.1
N$43: LED_K13.DIN(DI) R39.1
N$45: LED_K6.DIN(DI) R30.2
N$58: LED_K6.DO R31.2
N$59: LED_K7.DIN(DI) R31.1
N$60: LED_K7.DO R32.2
N$61: LED_K14.DIN(DI) R40.1
N$62: LED_K18.DIN(DI) R44.1
N$63: LED_K19.DIN(DI) R45.1
N$64: LED_K23.DIN(DI) R49.1
N$66: LED_K24.DIN(DI) R50.1
N$67: LED_K13.DO R40.2
N$68: LED_K15.DO R42.1
N$71: LED_K12.DIN(DI) R38.1
N$72: LED_K12.DO R39.2
N$73: LED_K14.DO R41.2
N$74: LED_K18.DO R45.2
N$75: LED_K19.DO R46.2
N$76: LED_K23.DO R50.2
N$77: LED_K24.DO R59.2
N$78: LED_K15.DIN(DI) R41.1
N$79: LED_K20.DO R47.1
N$80: LED_K16.DIN(DI) R42.2
N$81: LED_K16.DO R43.2
N$82: LED_K17.DIN(DI) R43.1
N$83: LED_K17.DO R44.2
N$84: LED_K20.DIN(DI) R46.1
N$85: LED_K25.DIN(DI) R59.1
N$87: LED_K9.DO R38.2
N$89: LED_K8.DIN(DI) R32.1
N$90: LED_K9.DIN(DI) R35.1
N$91: LED_K25.DO R76.1
N$92: LED_K21.DIN(DI) R47.2
N$93: LED_K21.DO R48.2
N$107: LED_K22.DIN(DI) R48.1
N$108: LED_K22.DO R49.2
N$109: LED_K8.DO R35.2
N$116: LED_K26.DIN(DI) R76.2
N$117: LED_K26.DO R85.2
N$118: LED_K27.DIN(DI) R85.1
N$119: LED_K27.DO R92.2
N$120: LED_K28.DIN(DI) R92.1
TIM3_CH2_TOP: R26.2 ; also sheet 1
Unconnected: LED_K28.DO

## Sheet 5 of 8: Top Leds
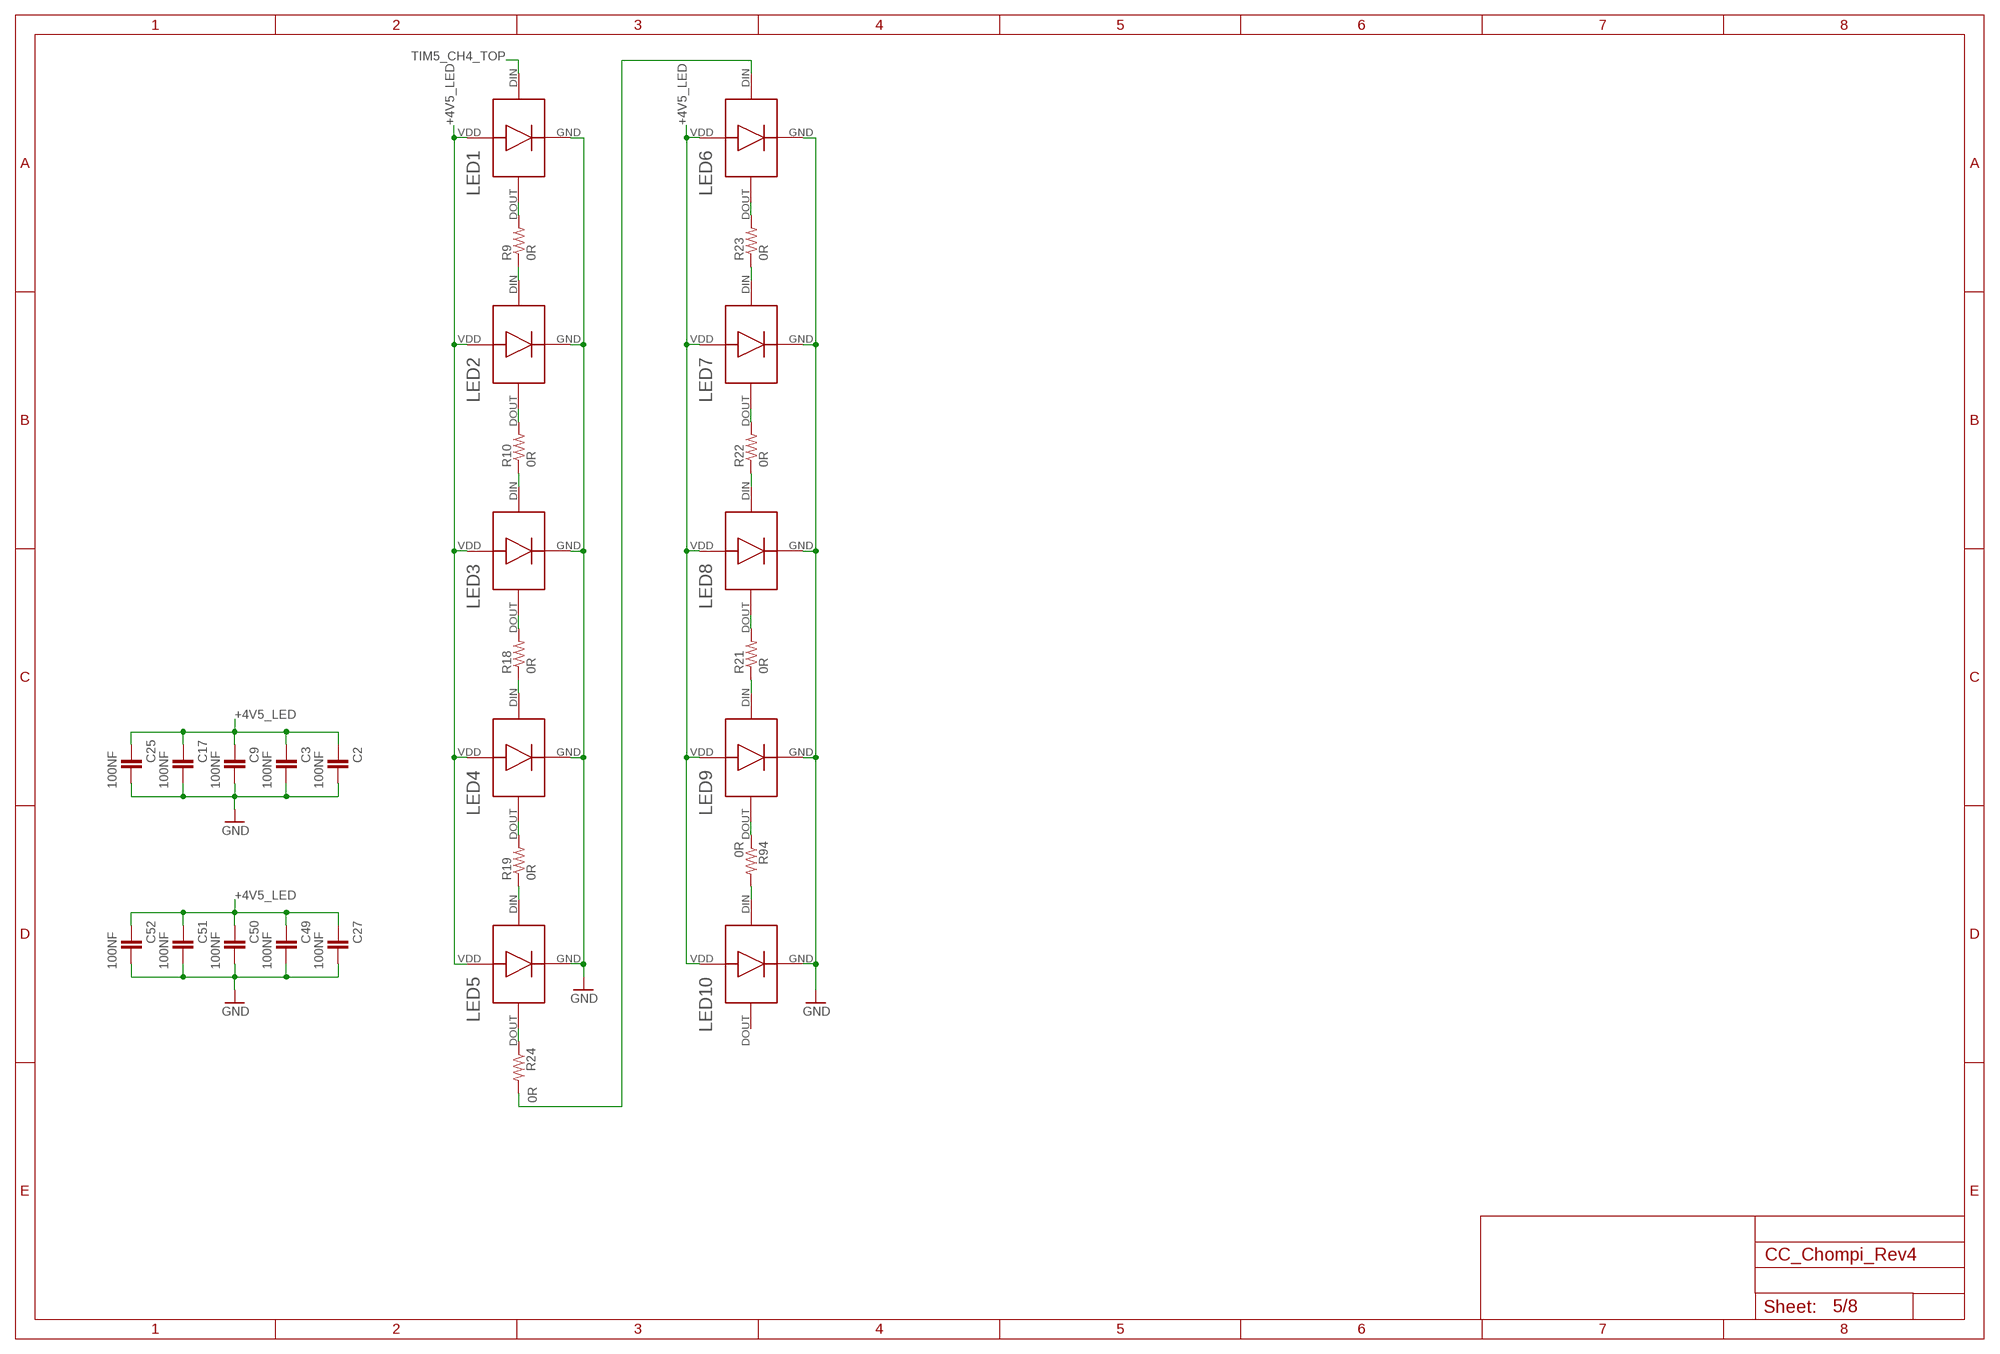
[diagram p4: schematic, sheet 5]

### Parts
C2  100NF  C-EUC0402  [C0402]
C3  100NF  C-EUC0402  [C0402]
C9  100NF  C-EUC0402  [C0402]
C17  100NF  C-EUC0402  [C0402]
C25  100NF  C-EUC0402  [C0402]
C27  100NF  C-EUC0402  [C0402]
C49  100NF  C-EUC0402  [C0402]
C50  100NF  C-EUC0402  [C0402]
C51  100NF  C-EUC0402  [C0402]
C52  100NF  C-EUC0402  [C0402]
LED1  WS2812D-F8  DIGITAL_LEDWS2812D-F8  [WS2812D-F8]
LED2  WS2812D-F8  DIGITAL_LEDWS2812D-F8  [WS2812D-F8]
LED3  DIGITAL_LEDWS2812D-F8-SPLIT  [WS2812D-F8-SPLIT]
LED4  WS2812D-F8  DIGITAL_LEDWS2812D-F8  [WS2812D-F8]
LED5  WS2812D-F8  DIGITAL_LEDWS2812D-F8  [WS2812D-F8]
LED6  DIGITAL_LEDWS2812D-F5  [WS2812D-F5]
LED7  DIGITAL_LEDWS2812D-F5  [WS2812D-F5]
LED8  DIGITAL_LEDWS2812D-F5  [WS2812D-F5]
LED9  DIGITAL_LEDWS2812D-F5  [WS2812D-F5]
LED10  WS2812D-F8  DIGITAL_LEDWS2812D-F8  [WS2812D-F8]
R9  0R  R-US_R0603  [R0603]
R10  0R  R-US_R0603  [R0603]
R18  0R  R-US_R0603  [R0603]
R19  0R  R-US_R0603  [R0603]
R21  0R  R-US_R0603  [R0603]
R22  0R  R-US_R0603  [R0603]
R23  0R  R-US_R0603  [R0603]
R24  0R  R-US_R0603  [R0603]
R94  0R  R-US_R0603  [R0603]

### Nets
+4V5_LED: C2.1 C3.1 C9.1 C17.1 C25.1 C27.1 C49.1 C50.1 C51.1 C52.1 LED1.VDD LED2.VDD LED3.VDD LED4.VDD LED5.VDD LED6.VDD LED7.VDD LED8.VDD LED9.VDD LED10.VDD ; also sheet 2,4
GND: C2.2 C3.2 C9.2 C17.2 C25.2 C27.2 C49.2 C50.2 C51.2 C52.2 LED1.GND(VSS) LED2.GND(VSS) LED3.GND(VSS) LED4.GND(VSS) LED5.GND(VSS) LED6.GND(VSS) LED7.GND(VSS) LED8.GND(VSS) LED9.GND(VSS) LED10.GND(VSS) ; also sheet 1,2,3,4,6,7,8
N$3: LED9.DOUT(DO) R94.1
N$12: LED10.DIN(DI) R94.2
N$14: LED8.DOUT(DO) R21.2
N$16: LED5.DOUT(DO) R24.1
N$18: LED1.DOUT(DO) R9.2
N$19: LED2.DIN(DI) R9.1
N$20: LED2.DOUT(DO) R10.2
N$21: LED3.DIN(DI) R10.1
N$22: LED3.DOUT(DO) R18.2
N$23: LED4.DIN(DI) R18.1
N$24: LED4.DOUT(DO) R19.2
N$25: LED5.DIN(DI) R19.1
N$26: LED9.DIN(DI) R21.1
N$27: LED7.DOUT(DO) R22.2
N$28: LED8.DIN(DI) R22.1
N$29: LED6.DOUT(DO) R23.2
N$30: LED7.DIN(DI) R23.1
N$31: LED6.DIN(DI) R24.2
TIM5_CH4_TOP: LED1.DIN(DI) ; also sheet 1
Unconnected: LED10.DOUT(DO)

## Sheet 6 of 8: Switch Mux
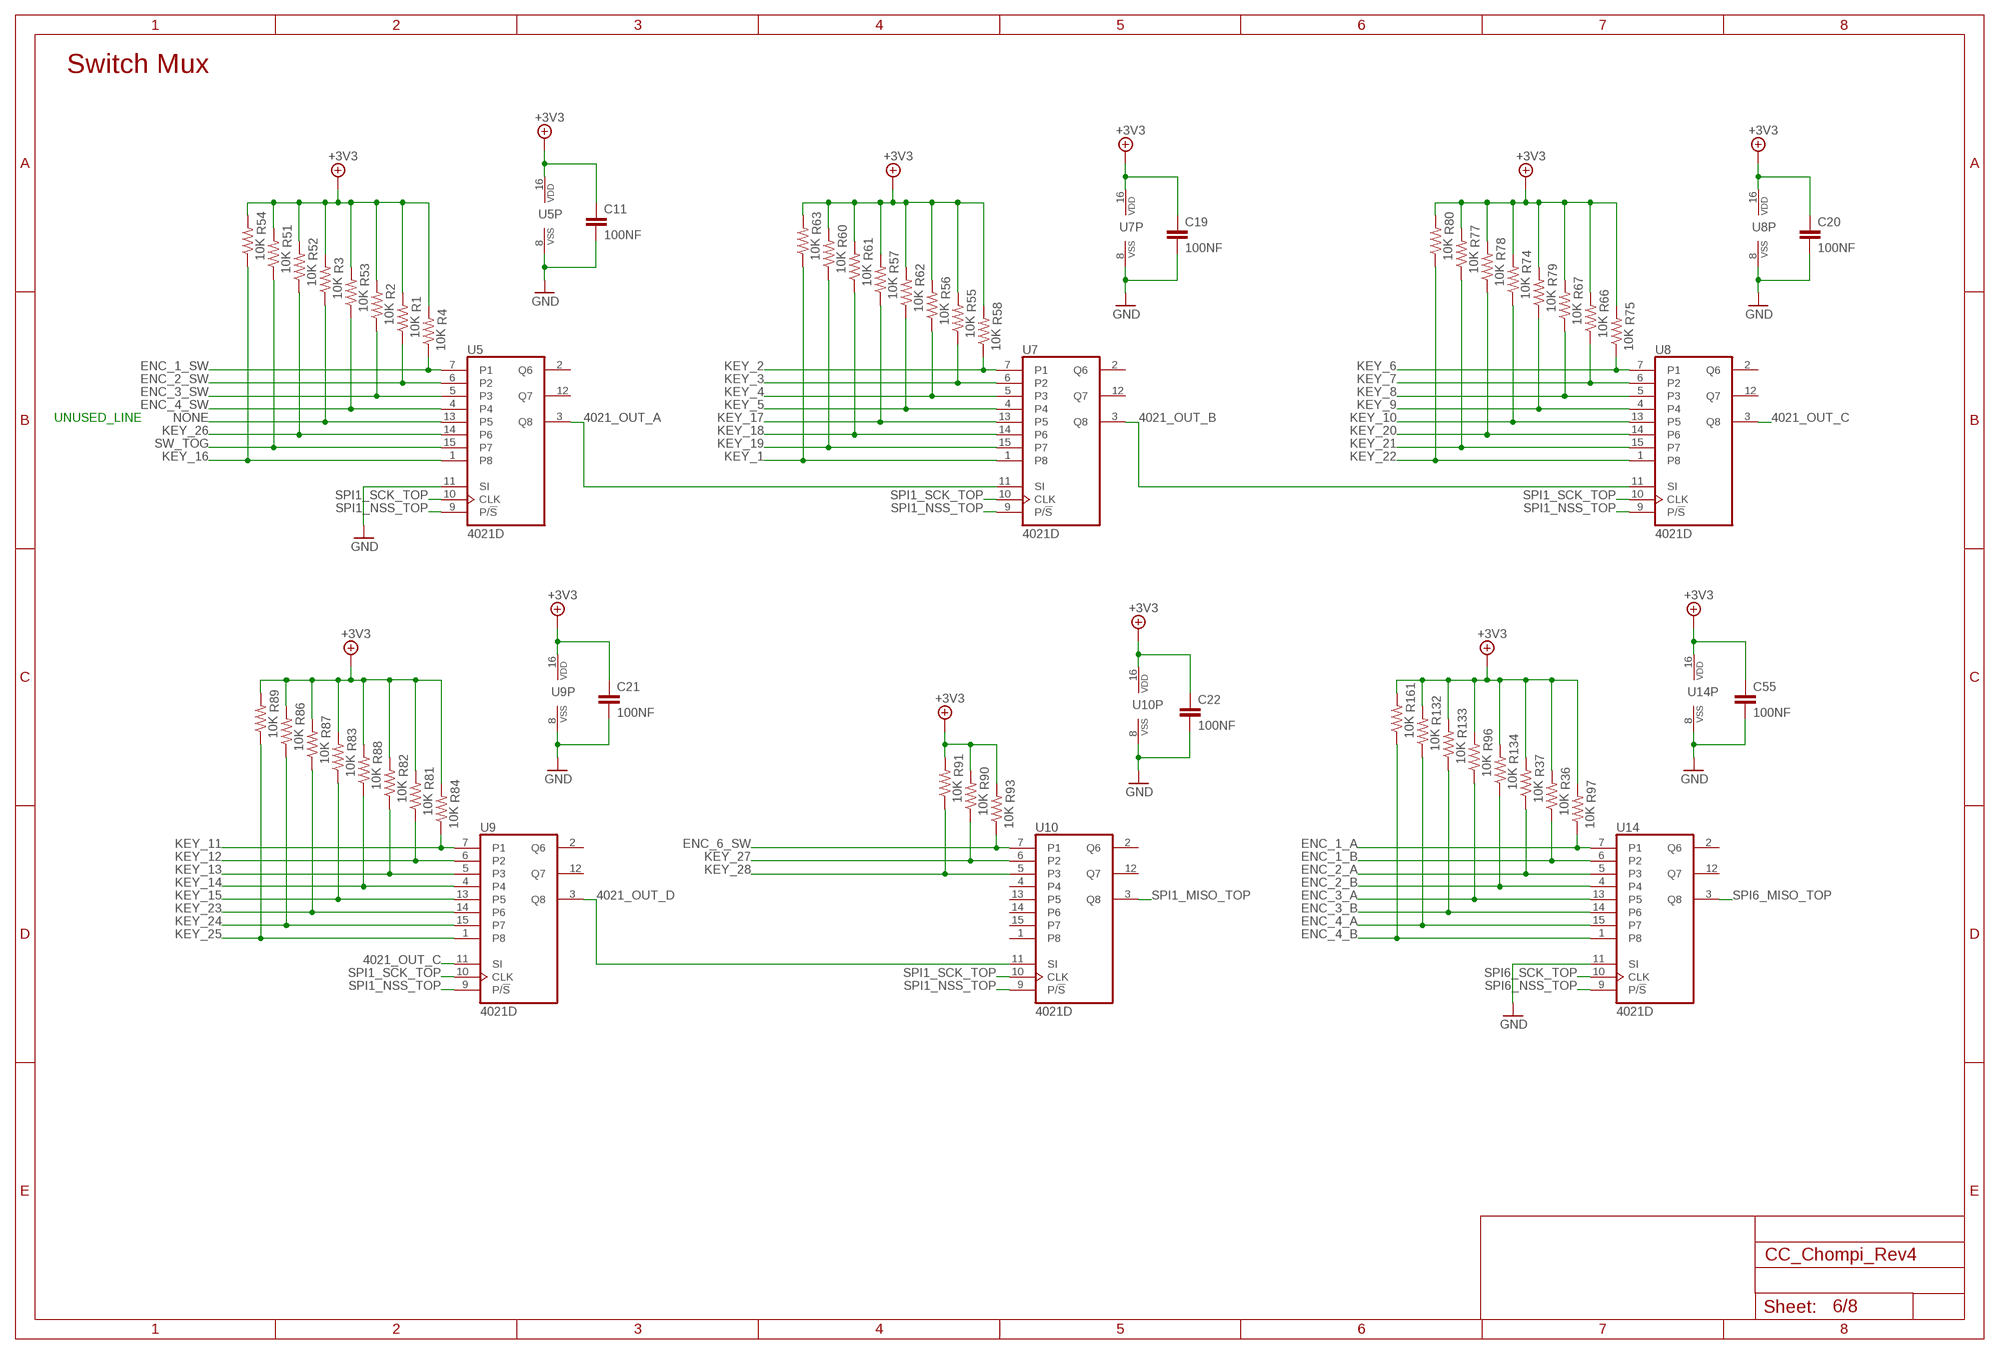
[diagram p5: schematic, sheet 6]

### Parts
C11  100NF  C-EUC0402  [C0402]
C19  100NF  C-EUC0402  [C0402]
C20  100NF  C-EUC0402  [C0402]
C21  100NF  C-EUC0402  [C0402]
C22  100NF  C-EUC0402  [C0402]
C55  100NF  C-EUC0402  [C0402]
R1  10K  R-US_R0603  [R0603]
R2  10K  R-US_R0603  [R0603]
R3  10K  R-US_R0603  [R0603]
R4  10K  R-US_R0603  [R0603]
R36  10K  R-US_R0603  [R0603]
R37  10K  R-US_R0603  [R0603]
R51  10K  R-US_R0603  [R0603]
R52  10K  R-US_R0603  [R0603]
R53  10K  R-US_R0603  [R0603]
R54  10K  R-US_R0603  [R0603]
R55  10K  R-US_R0603  [R0603]
R56  10K  R-US_R0603  [R0603]
R57  10K  R-US_R0603  [R0603]
R58  10K  R-US_R0603  [R0603]
R60  10K  R-US_R0603  [R0603]
R61  10K  R-US_R0603  [R0603]
R62  10K  R-US_R0603  [R0603]
R63  10K  R-US_R0603  [R0603]
R66  10K  R-US_R0603  [R0603]
R67  10K  R-US_R0603  [R0603]
R74  10K  R-US_R0603  [R0603]
R75  10K  R-US_R0603  [R0603]
R77  10K  R-US_R0603  [R0603]
R78  10K  R-US_R0603  [R0603]
R79  10K  R-US_R0603  [R0603]
R80  10K  R-US_R0603  [R0603]
R81  10K  R-US_R0603  [R0603]
R82  10K  R-US_R0603  [R0603]
R83  10K  R-US_R0603  [R0603]
R84  10K  R-US_R0603  [R0603]
R86  10K  R-US_R0603  [R0603]
R87  10K  R-US_R0603  [R0603]
R88  10K  R-US_R0603  [R0603]
R89  10K  R-US_R0603  [R0603]
R90  10K  R-US_R0603  [R0603]
R91  10K  R-US_R0603  [R0603]
R93  10K  R-US_R0603  [R0603]
R96  10K  R-US_R0603  [R0603]
R97  10K  R-US_R0603  [R0603]
R132  10K  R-US_R0603  [R0603]
R133  10K  R-US_R0603  [R0603]
R134  10K  R-US_R0603  [R0603]
R161  10K  R-US_R0603  [R0603]
U5  4021D  [SO-16]
U7  4021D  [SO-16]
U8  4021D  [SO-16]
U9  4021D  [SO-16]
U10  4021D  [SO-16]
U14  4021D  [SO-16]

### Nets
4021_OUT_A: U5.3(Q8) U7.11(SI)
4021_OUT_B: U7.3(Q8) U8.11(SI)
4021_OUT_C: U8.3(Q8) U9.11(SI)
4021_OUT_D: U9.3(Q8) U10.11(SI)
+3V3: C11.1 C19.1 C20.1 C21.1 C22.1 C55.1 R1.2 R2.2 R3.2 R4.2 R36.2 R37.2 R51.2 R52.2 R53.2 R54.2 R55.2 R56.2 R57.2 R58.2 R60.2 R61.2 R62.2 R63.2 R66.2 R67.2 R74.2 R75.2 R77.2 R78.2 R79.2 R80.2 R81.2 R82.2 R83.2 R84.2 R86.2 R87.2 R88.2 R89.2 R90.2 R91.2 R93.2 R96.2 R97.2 R132.2 R133.2 R134.2 R161.2 U5.16(VDD) U7.16(VDD) U8.16(VDD) U9.16(VDD) U10.16(VDD) U14.16(VDD) ; also sheet 1,2,3,7
ENC_1_A: R97.1 U14.7(P1) ; also sheet 3
ENC_1_B: R36.1 U14.6(P2) ; also sheet 3
ENC_1_SW: R4.1 U5.7(P1) ; also sheet 3
ENC_2_A: R37.1 U14.5(P3) ; also sheet 3
ENC_2_B: R134.1 U14.4 ; also sheet 3
ENC_2_SW: R1.1 U5.6(P2) ; also sheet 3
ENC_3_A: R96.1 U14.13(P5) ; also sheet 3
ENC_3_B: R133.1 U14.14(P6) ; also sheet 3
ENC_3_SW: R2.1 U5.5(P3) ; also sheet 3
ENC_4_A: R132.1 U14.15(P7) ; also sheet 3
ENC_4_B: R161.1 U14.1(P8) ; also sheet 3
ENC_4_SW: R53.1 U5.4 ; also sheet 3
ENC_6_SW: R93.1 U10.7(P1) ; also sheet 3
GND: C11.2 C19.2 C20.2 C21.2 C22.2 C55.2 U5.8(VSS) U5.11(SI) U7.8(VSS) U8.8(VSS) U9.8(VSS) U10.8(VSS) U14.8(VSS) U14.11(SI) ; also sheet 1,2,3,4,5,7,8
KEY_1: R63.1 U7.1(P8) ; also sheet 3
KEY_2: R58.1 U7.7(P1) ; also sheet 3
KEY_3: R55.1 U7.6(P2) ; also sheet 3
KEY_4: R56.1 U7.5(P3) ; also sheet 3
KEY_5: R62.1 U7.4 ; also sheet 3
KEY_6: R75.1 U8.7(P1) ; also sheet 3
KEY_7: R66.1 U8.6(P2) ; also sheet 3
KEY_8: R67.1 U8.5(P3) ; also sheet 3
KEY_9: R79.1 U8.4 ; also sheet 3
KEY_10: R74.1 U8.13(P5) ; also sheet 3
KEY_11: R84.1 U9.7(P1) ; also sheet 3
KEY_12: R81.1 U9.6(P2) ; also sheet 3
KEY_13: R82.1 U9.5(P3) ; also sheet 3
KEY_14: R88.1 U9.4 ; also sheet 3
KEY_15: R83.1 U9.13(P5) ; also sheet 3
KEY_16: R54.1 U5.1(P8) ; also sheet 3
KEY_17: R57.1 U7.13(P5) ; also sheet 3
KEY_18: R61.1 U7.14(P6) ; also sheet 3
KEY_19: R60.1 U7.15(P7) ; also sheet 3
KEY_20: R78.1 U8.14(P6) ; also sheet 3
KEY_21: R77.1 U8.15(P7) ; also sheet 3
KEY_22: R80.1 U8.1(P8) ; also sheet 3
KEY_23: R87.1 U9.14(P6) ; also sheet 3
KEY_24: R86.1 U9.15(P7) ; also sheet 3
KEY_25: R89.1 U9.1(P8) ; also sheet 3
KEY_26: R52.1 U5.14(P6) ; also sheet 3
KEY_27: R90.1 U10.6(P2) ; also sheet 3
KEY_28: R91.1 U10.5(P3) ; also sheet 3
NONE: R3.1 U5.13(P5)
SPI1_MISO_TOP: U10.3(Q8) ; also sheet 1
SPI1_NSS_TOP: U5.9(P/!S) U7.9(P/!S) U8.9(P/!S) U9.9(P/!S) U10.9(P/!S) ; also sheet 1
SPI1_SCK_TOP: U5.10(CLK) U7.10(CLK) U8.10(CLK) U9.10(CLK) U10.10(CLK) ; also sheet 1
SPI6_MISO_TOP: U14.3(Q8) ; also sheet 1
SPI6_NSS_TOP: U14.9(P/!S) ; also sheet 1
SPI6_SCK_TOP: U14.10(CLK) ; also sheet 1
SW_TOG: R51.1 U5.15(P7) ; also sheet 3
Unconnected: U5.2(Q6) U5.12(Q7) U7.2(Q6) U7.12(Q7) U8.2(Q6) U8.12(Q7) U9.2(Q6) U9.12(Q7) U10.1(P8) U10.2(Q6) U10.4 U10.12(Q7) U10.13(P5) U10.14(P6) U10.15(P7) U14.2(Q6) U14.12(Q7)

### Notes on the sheet
- Switch Mux
- UNUSED_LINE

## Sheet 7 of 8: External Audio
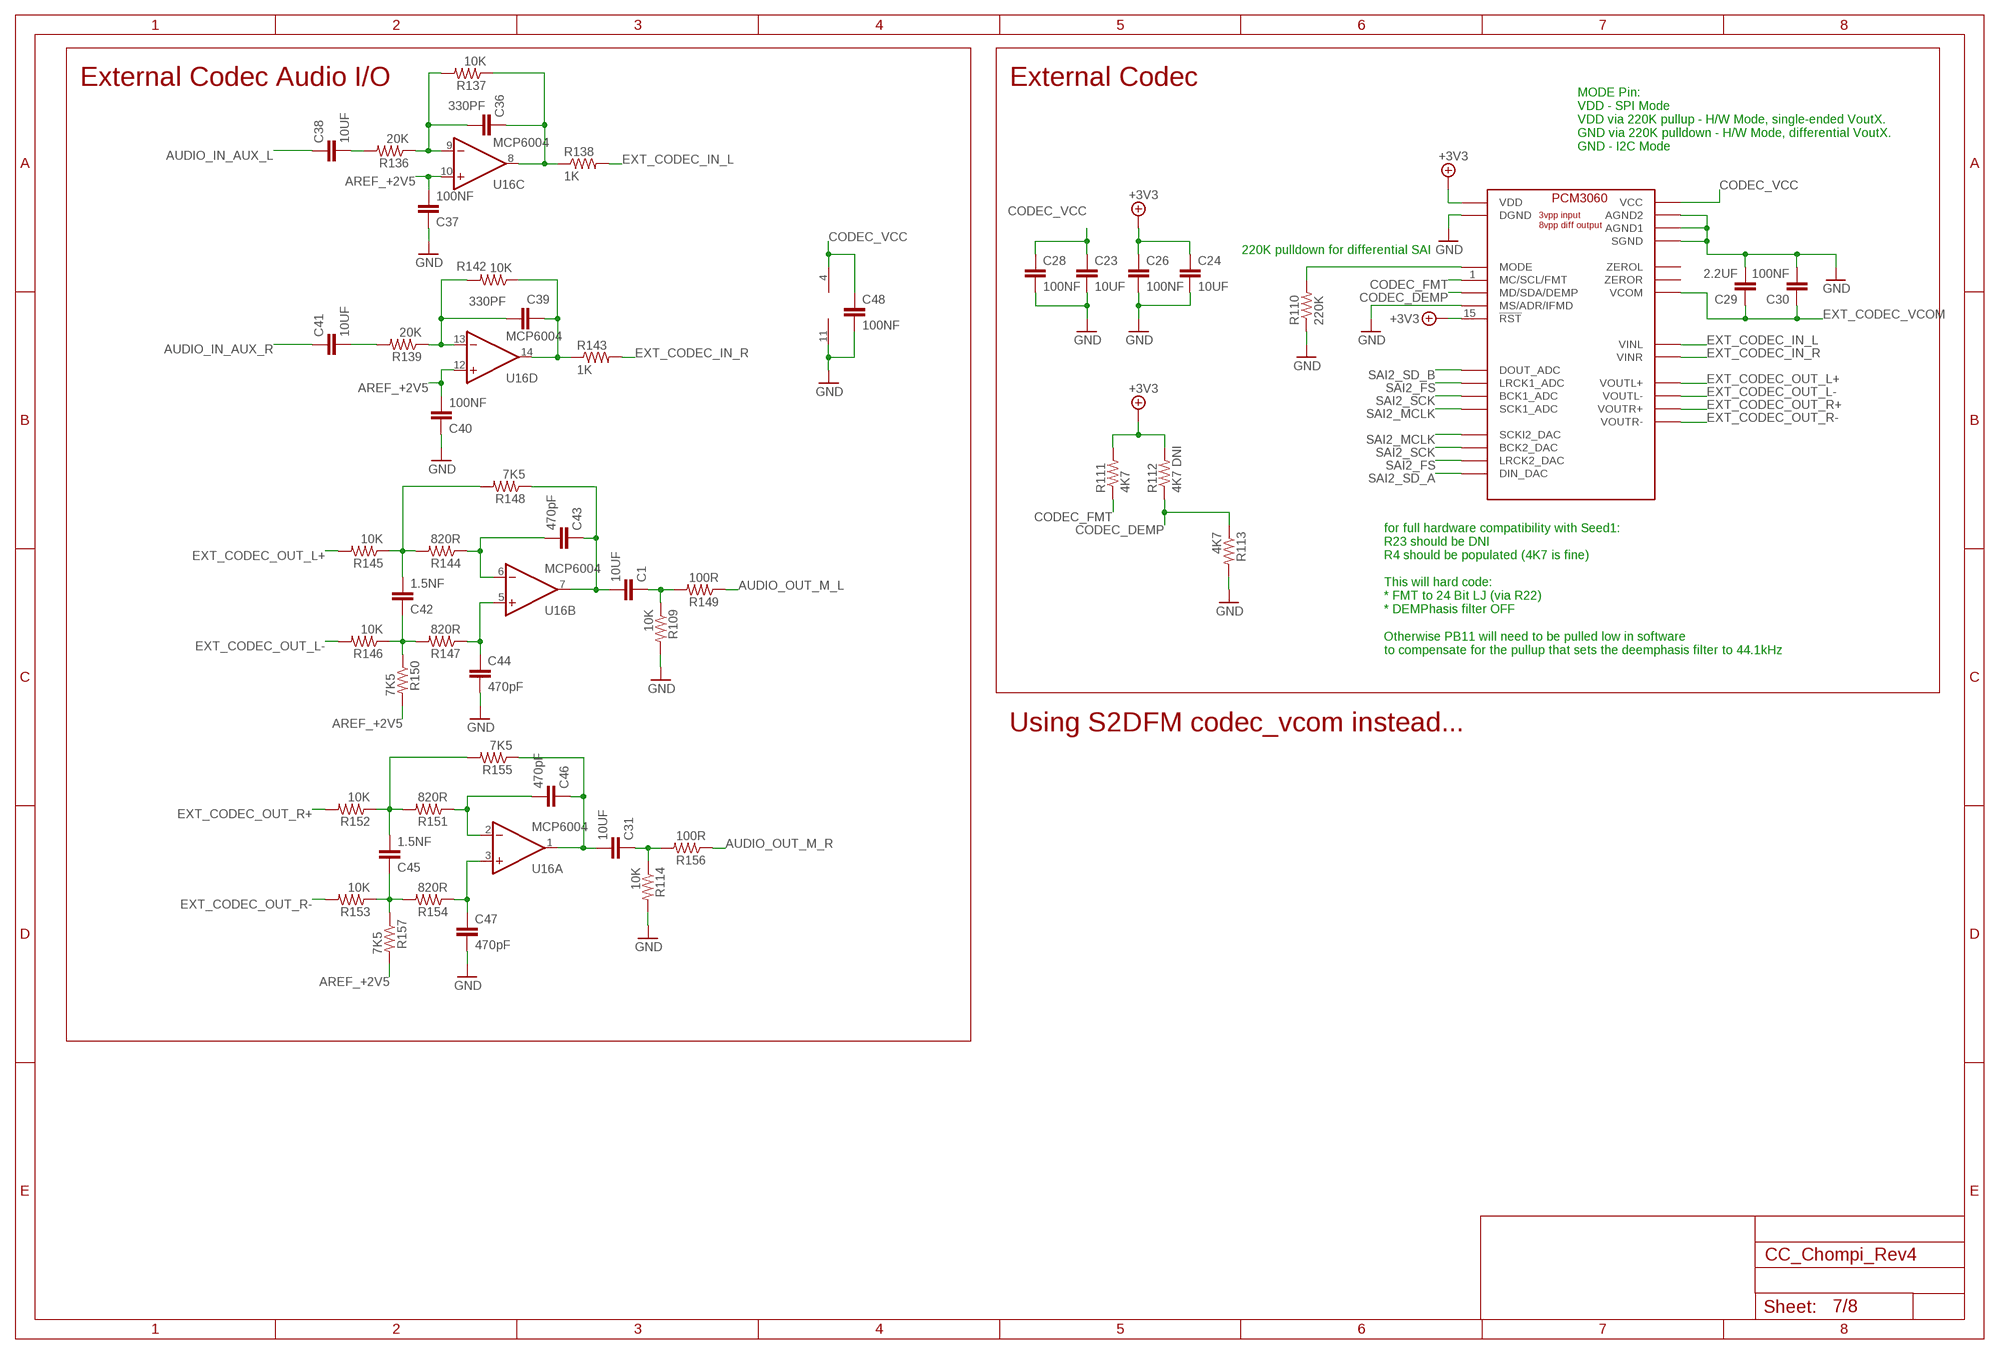
[diagram p6: schematic, sheet 7]

### Parts
C1  10UF  C-EUC0805  [C0805]
C23  10UF  C-EUC0805  [C0805]
C24  10UF  C-EUC0805  [C0805]
C26  100NF  C-EUC0402  [C0402]
C28  100NF  C-EUC0402  [C0402]
C29  2.2UF  C-EUC0603  [C0603]
C30  100NF  C-EUC0402  [C0402]
C31  10UF  C-EUC0805  [C0805]
C36  330PF  C-EUC0603  [C0603]
C37  100NF  C-EUC0402  [C0402]
C38  10UF  C-EUC0805  [C0805]
C39  330PF  C-EUC0603  [C0603]
C40  100NF  C-EUC0402  [C0402]
C41  10UF  C-EUC0805  [C0805]
C42  1.5NF  C-EUC0603  [C0603]
C43  470pF  C-EUC0603  [C0603]
C44  470pF  C-EUC0603  [C0603]
C45  1.5NF  C-EUC0603  [C0603]
C46  470pF  C-EUC0603  [C0603]
C47  470pF  C-EUC0603  [C0603]
C48  100NF  C-EUC0402  [C0402]
R109  10K  R-US_R0603  [R0603]
R110  220K  R-US_R0603  [R0603]
R111  4K7  R-US_R0603  [R0603]
R112  4K7 DNI  R-US_R0603  [R0603]
R113  4K7  R-US_R0603  [R0603]
R114  10K  R-US_R0603  [R0603]
R136  20K  R-US_R0603  [R0603]
R137  10K  R-US_R0603  [R0603]
R138  1K  R-US_R0402  [R0402]
R139  20K  R-US_R0603  [R0603]
R142  10K  R-US_R0603  [R0603]
R143  1K  R-US_R0402  [R0402]
R144  820R  R-US_R0603  [R0603]
R145  10K  R-US_R0603  [R0603]
R146  10K  R-US_R0603  [R0603]
R147  820R  R-US_R0603  [R0603]
R148  7K5  R-US_R0603  [R0603]
R149  100R  R-US_R0603  [R0603]
R150  7K5  R-US_R0603  [R0603]
R151  820R  R-US_R0603  [R0603]
R152  10K  R-US_R0603  [R0603]
R153  10K  R-US_R0603  [R0603]
R154  820R  R-US_R0603  [R0603]
R155  7K5  R-US_R0603  [R0603]
R156  100R  R-US_R0603  [R0603]
R157  7K5  R-US_R0603  [R0603]
U12  PCM3060  PCM3060PWR  [TSSOP-28]
U16  MCP6004  MCP6004_TSSOP-14  [TSSOP-14]

### Nets
+3V3: C24.1 C26.1 R111.2 R112.2 U12.7(VDD) U12.15(!RST) ; also sheet 1,2,3,6
AREF_+2V5: C37.2 C40.2 R150.2 R157.2 U16.10(C:+IN) U16.12(D:+IN) ; also sheet 8
AUDIO_IN_AMP_LEFT2: C38.2 R136.2
AUDIO_IN_AUX_L: C38.1 ; also sheet 3
AUDIO_IN_AUX_R: C41.1 ; also sheet 3
AUDIO_OUT_M_L: R149.1 ; also sheet 3
AUDIO_OUT_M_R: R156.1 ; also sheet 3
CODEC_DEMP [DATA]: R112.1 R113.1 U12.2(MD/SDA/DEMP)
CODEC_FMT [DATA]: R111.1 U12.1(MC/SCL/FMT)
CODEC_VCC: C23.1 C28.1 C48.1 U12.24(VCC) U16.4(P:V+) ; also sheet 2,8
EXT_CODEC_IN_L [CODEC]: R138.2 U12.25(VINL)
EXT_CODEC_IN_R: R143.2 U12.26(VINR)
EXT_CODEC_OUT_L+: R145.2 U12.20(VOUTL+)
EXT_CODEC_OUT_L-: R146.2 U12.19(VOUTL-)
EXT_CODEC_OUT_R+: R152.2 U12.18(VOUTR+)
EXT_CODEC_OUT_R-: R153.2 U12.17(VOUTR-)
EXT_CODEC_VCOM: C29.1 C30.1 U12.21(VCOM)
GND: C23.2 C24.2 C26.2 C28.2 C29.2 C30.2 C37.1 C40.1 C44.2 C47.2 C48.2 R109.2 R110.1 R113.2 R114.2 U12.8(DGND) U12.16(SGND) U12.22(AGND2) U12.23(AGND1) U12.27(MS/ADR/IFMD) U16.11(P:V-) ; also sheet 1,2,3,4,5,6,8
HEADPHONE_IN_L2: C1.2 C43.1 R148.1 U16.7(B:OUT)
HEADPHONE_IN_R2: C31.2 C46.1 R155.1 U16.1(A:OUT)
N$2: R110.2 U12.28(MODE)
N$4: C1.1 R109.1 R149.2
N$5: C31.1 R114.1 R156.2
N$94: C36.1 R137.1 R138.1 U16.8(C:OUT)
N$95: C36.2 R136.1 R137.2 U16.9(C:-IN)
N$96: C39.1 R142.1 R143.1 U16.14(D:OUT)
N$97: C39.2 R139.1 R142.2 U16.13(D:-IN)
N$98: C41.2 R139.2
N$99: C43.2 R144.1 U16.6(B:-IN)
N$100: C44.1 R147.1 U16.5(B:+IN)
N$101: C42.1 R146.1 R147.2 R150.1
N$102: C42.2 R144.2 R145.1 R148.2
N$103: C46.2 R151.1 U16.2(A:-IN)
N$104: C47.1 R154.1 U16.3(A:+IN)
N$105: C45.1 R153.1 R154.2 R157.1
N$106: C45.2 R151.2 R152.1 R155.2
SAI2_FS: U12.4(LRCK1_ADC) U12.11(LRCK2_DAC) ; also sheet 1
SAI2_MCLK: U12.6(SCK1_ADC) U12.9(SCKI2_DAC) ; also sheet 1
SAI2_SCK: U12.5(BCK1_ADC) U12.10(BCK2_DAC) ; also sheet 1
SAI2_SD_A: U12.12(DIN_DAC) ; also sheet 1
SAI2_SD_B: U12.3(DOUT_ADC) ; also sheet 1
Unconnected: U12.13(ZEROR) U12.14(ZEROL)

### Notes on the sheet
- External Codec Audio I/O | External Codec
- MODE Pin:
  VDD - SPI Mode
  VDD via 220K pullup - H/W Mode, single-ended VoutX.
  GND via 220K pulldown - H/W Mode, differential VoutX.
  GND - I2C Mode
- 220K pulldown for differential SAI
- for full hardware compatibility with Seed1:
  R23 should be DNI
  R4 should be populated (4K7 is fine)
  
  This will hard code:
  * FMT to 24 Bit LJ (via R22)
  * DEMPhasis filter OFF
  
  Otherwise PB11 will need to be pulled low in software
  to compensate for the pullup that sets the deemphasis filter to 44.1kHz
- Using S2DFM codec_vcom instead...

## Sheet 8 of 8: Internal Audio
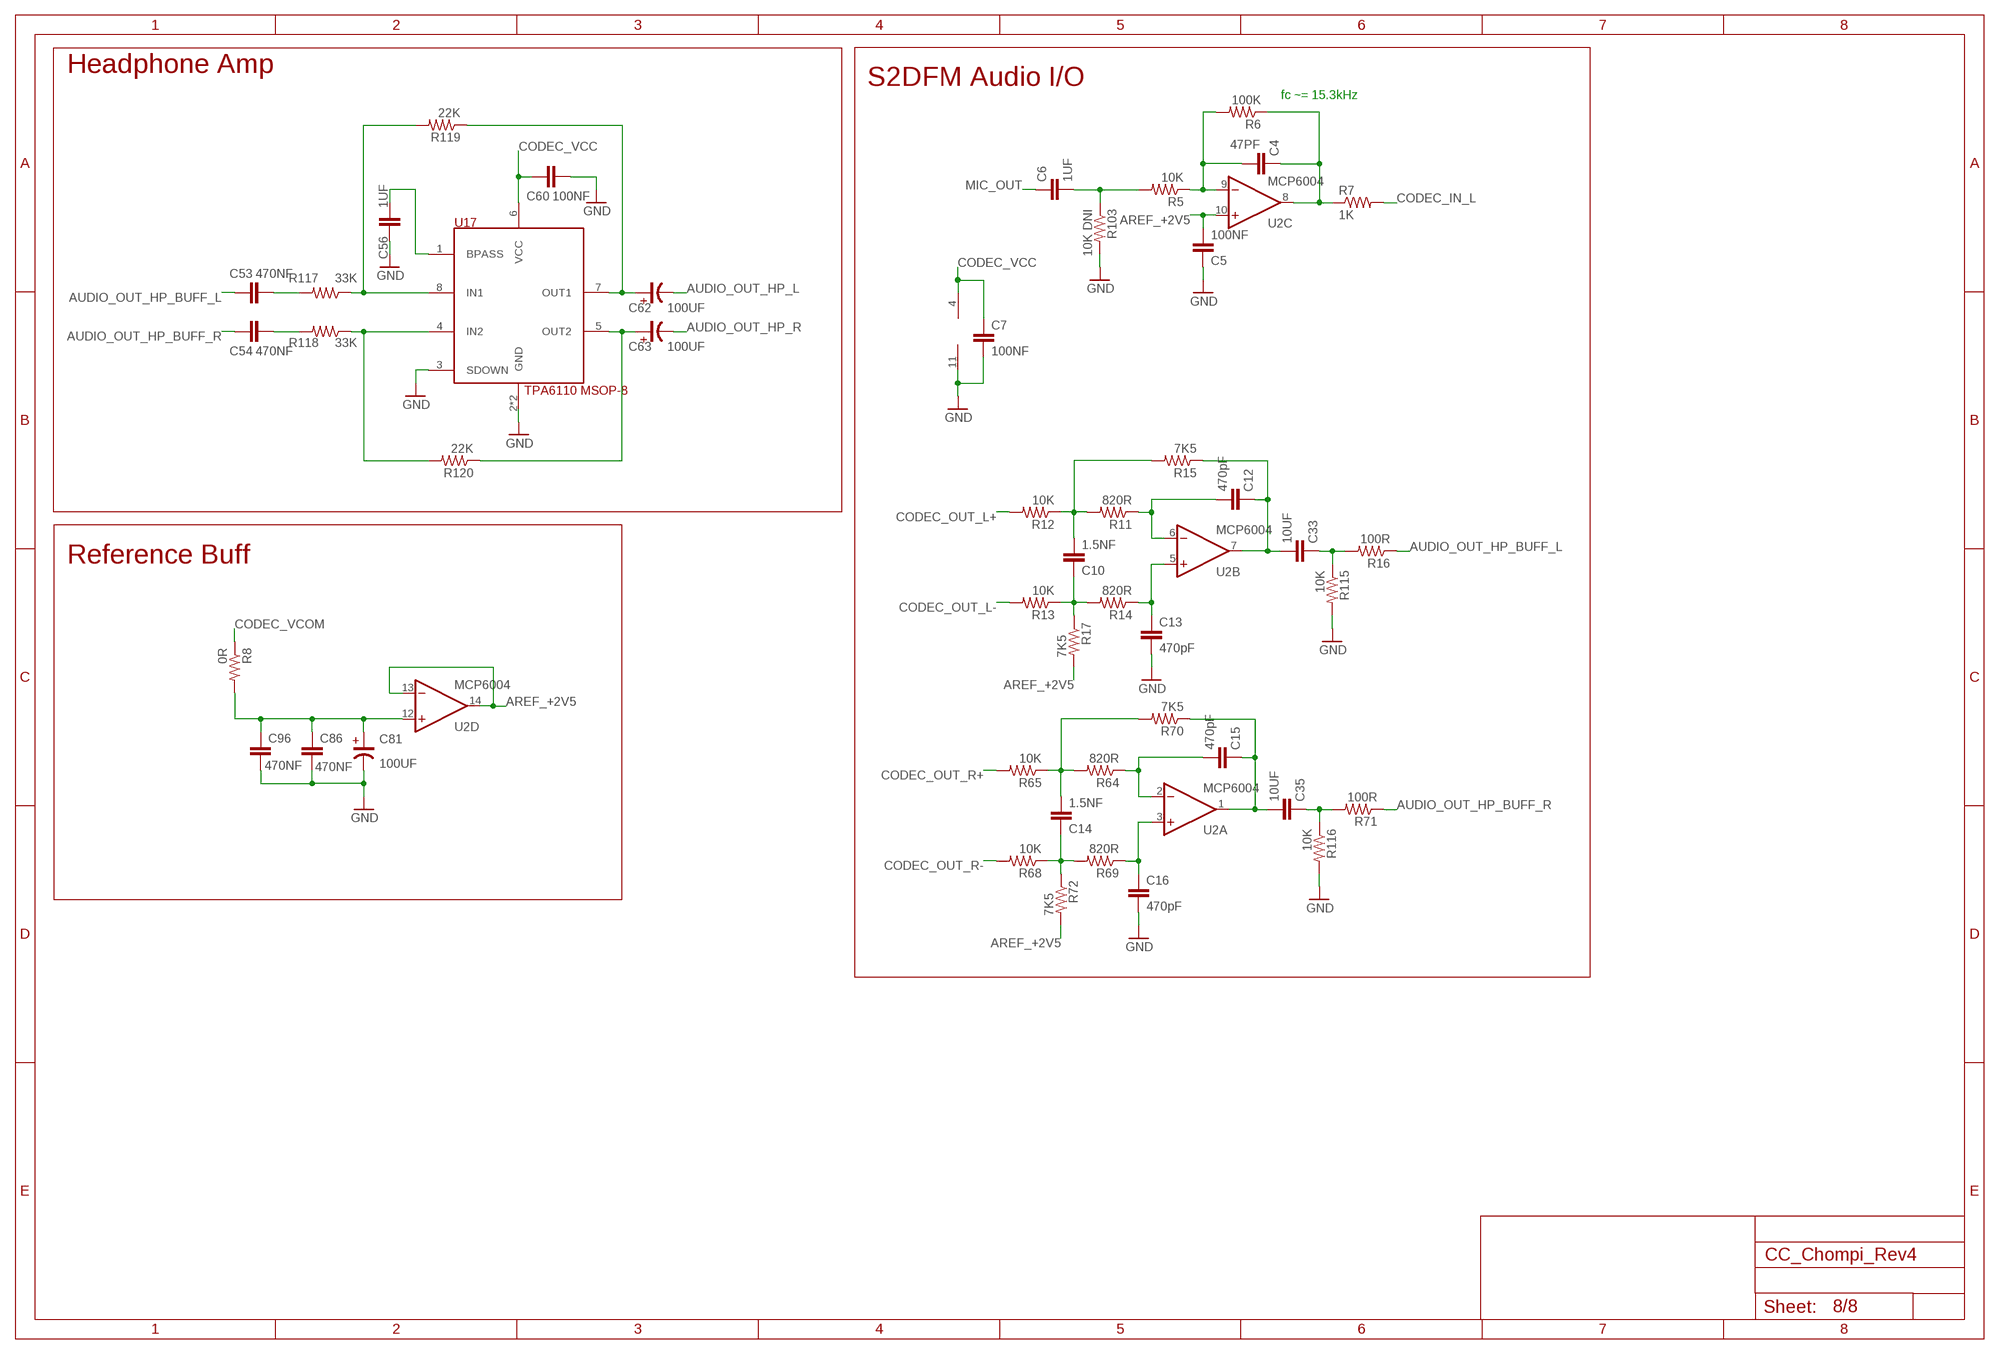
[diagram p7: schematic, sheet 8]

### Parts
C4  47PF  C-EUC0603  [C0603]
C5  100NF  C-EUC0402  [C0402]
C6  1UF  C-EUC0603  [C0603]
C7  100NF  C-EUC0402  [C0402]
C10  1.5NF  C-EUC0603  [C0603]
C12  470pF  C-EUC0603  [C0603]
C13  470pF  C-EUC0603  [C0603]
C14  1.5NF  C-EUC0603  [C0603]
C15  470pF  C-EUC0603  [C0603]
C16  470pF  C-EUC0603  [C0603]
C33  10UF  C-EUC0805  [C0805]
C35  10UF  C-EUC0805  [C0805]
C53  470NF  C-EUC0603  [C0603]
C54  470NF  C-EUC0603  [C0603]
C56  1UF  C-EUC0603  [C0603]
C60  100NF  C-EUC0402  [C0402]
C62  100UF  C-EU-POL_D  [PANASONIC_D]
C63  100UF  C-EU-POL_D  [PANASONIC_D]
C81  100UF  C-EU-POL_D  [PANASONIC_D]
C86  470NF  C-EUC0603  [C0603]
C96  470NF  C-EUC0603  [C0603]
R5  10K  R-US_R0603  [R0603]
R6  100K  R-US_R0402  [R0402]
R7  1K  R-US_R0402  [R0402]
R8  0R  R-US_R0603  [R0603]
R11  820R  R-US_R0603  [R0603]
R12  10K  R-US_R0603  [R0603]
R13  10K  R-US_R0603  [R0603]
R14  820R  R-US_R0603  [R0603]
R15  7K5  R-US_R0603  [R0603]
R16  100R  R-US_R0603  [R0603]
R17  7K5  R-US_R0603  [R0603]
R64  820R  R-US_R0603  [R0603]
R65  10K  R-US_R0603  [R0603]
R68  10K  R-US_R0603  [R0603]
R69  820R  R-US_R0603  [R0603]
R70  7K5  R-US_R0603  [R0603]
R71  100R  R-US_R0603  [R0603]
R72  7K5  R-US_R0603  [R0603]
R103  10K DNI  R-US_R0603  [R0603]
R115  10K  R-US_R0603  [R0603]
R116  10K  R-US_R0603  [R0603]
R117  33K  R-US_R0603  [R0603]
R118  33K  R-US_R0603  [R0603]
R119  22K  R-US_R0603  [R0603]
R120  22K  R-US_R0603  [R0603]
U2  MCP6004  MCP6004_TSSOP-14  [TSSOP-14]
U17  TPA6110 MSOP-8  TPA6110MSOP  [MSOP_8_PWRPAD]

### Nets
AREF_+2V5: C5.2 R17.2 R72.2 U2.10(C:+IN) U2.13(D:-IN) U2.14(D:OUT) ; also sheet 7
AUDIO_IN_AMP_LEFT1: C6.2 R5.2 R103.1
AUDIO_OUT_HP_BUFF_L: C53.1 R16.1
AUDIO_OUT_HP_BUFF_R: C54.1 R71.1
AUDIO_OUT_HP_L: C62.-(NEG) ; also sheet 3
AUDIO_OUT_HP_R: C63.-(NEG) ; also sheet 3
CODEC_IN_L: R7.2 ; also sheet 1
CODEC_OUT_L+ [CODEC]: R12.2 ; also sheet 1
CODEC_OUT_L- [CODEC]: R13.2 ; also sheet 1
CODEC_OUT_R+ [CODEC]: R65.2 ; also sheet 1
CODEC_OUT_R- [CODEC]: R68.2 ; also sheet 1
CODEC_VCC: C7.1 C60.2 U2.4(P:V+) U17.6(VCC) ; also sheet 2,7
CODEC_VCOM: R8.1 ; also sheet 1
GND: C5.1 C7.2 C13.2 C16.2 C56.1 C60.1 C81.-(NEG) C86.1 C96.1 R103.2 R115.2 R116.2 U2.11(P:V-) U17.2(GND) U17.3(SDOWN) U17.9(GND) ; also sheet 1,2,3,4,5,6,7
HEADPHONE_IN_L1: C12.1 C33.2 R15.1 U2.7(B:OUT)
HEADPHONE_IN_R1: C15.1 C35.2 R70.1 U2.1(A:OUT)
MIC_OUT: C6.1 ; also sheet 3
N$6: C33.1 R16.2 R115.1
N$7: C35.1 R71.2 R116.1
N$8 [DATA]: C53.2 R117.2
N$9 [DATA]: C54.2 R118.2
N$10: C4.1 R6.1 R7.1 U2.8(C:OUT)
N$11: C4.2 R5.1 R6.2 U2.9(C:-IN)
N$13: C81.+(POS) C86.2 C96.2 R8.2 U2.12(D:+IN)
N$15: C12.2 R11.1 U2.6(B:-IN)
N$46: C13.1 R14.1 U2.5(B:+IN)
N$47 [DATA]: R117.1 R119.2 U17.8(IN1)
N$48 [DATA]: R118.1 R120.2 U17.4(IN2)
N$49 [DATA]: C56.2 U17.1(BPASS)
N$50: C10.1 R13.1 R14.2 R17.1
N$51 [DATA]: C62.+(POS) R119.1 U17.7(OUT1)
N$52: C10.2 R11.2 R12.1 R15.2
N$53: C15.2 R64.1 U2.2(A:-IN)
N$54: C16.1 R69.1 U2.3(A:+IN)
N$55: C14.1 R68.1 R69.2 R72.1
N$56: C14.2 R64.2 R65.1 R70.2
N$57 [DATA]: C63.+(POS) R120.1 U17.5(OUT2)

### Notes on the sheet
- Headphone Amp
- S2DFM Audio I/O
- fc ~= 15.3kHz
- Reference Buff

## Library data of the parts
C1 C31 C33 C35 C85 C97 = Electrosmith-Misc:C-EU: CAPACITOR, European symbol
C2 C3 C5 C7-C9 C11 C17-C22 C25-C28 C30 C32 C37 C40 C48-C52 C55 C57-C61 C64-C80 C82 C83 C87 C88 C109 C111 = Electrosmith-Passives:C-EU: CAPACITOR, European symbol
C4 C6 C10 C12-C16 C29 C36 C39 C42-C47 C53 C54 C56 C84 C86 C96 C100 C102 C104 C113 = Electrosmith-Passives:C-EU: CAPACITOR, European symbol; PACKAGE: C0603
C23 C24 C34 C38 C41 C89-C91 C94 C103 C105 C106 C112 = Electrosmith-Passives:C-EU: CAPACITOR, European symbol; PACKAGE: C0805
C62 C63 C81 C92 C93 C95 C98 C99 C107 C108 C110 = Electrosmith-Passives:C-EU-POL
C101 = Electrosmith-Passives:C-EU: CAPACITOR, European symbol; PACKAGE: C1206
D1-D6 = Electrosmith-Semiconductors:DIODE: Diode SMADIODE - SMA Surface Mount Package 20V 1A Schottky Diode Digikey: 641-1014-6-ND DO-1N4148 - Through Hole Small Current Diode SOD-123 20V 1 A (.5mV Vf) Schottky Diode - Digikey: MBRX120TPMSCT-ND SOD-323 10V 570mA (.38mV Vf, 3ns) Schottky Diode - Digikey: ZLLS410CT-ND SOD-523 30V 30mA Schottky Diode (RB751S-40TE61) - Digikey: RB751S-40TE61CT-ND SOT23-R/W - SOT23 Package (R = Solder Paste/Reflow Ovens, W = Hand-Soldering) BAT54Film 40V 300mA - Digikey: 497-7162-1-ND; PACKAGE: SOD-323
D7 = Electrosmith-Semiconductors:DIODE: Diode SMADIODE - SMA Surface Mount Package 20V 1A Schottky Diode Digikey: 641-1014-6-ND DO-1N4148 - Through Hole Small Current Diode SOD-123 20V 1 A (.5mV Vf) Schottky Diode - Digikey: MBRX120TPMSCT-ND SOD-323 10V 570mA (.38mV Vf, 3ns) Schottky Diode - Digikey: ZLLS410CT-ND SOD-523 30V 30mA Schottky Diode (RB751S-40TE61) - Digikey: RB751S-40TE61CT-ND SOT23-R/W - SOT23 Package (R = Solder Paste/Reflow Ovens, W = Hand-Soldering) BAT54Film 40V 300mA - Digikey: 497-7162-1-ND; PACKAGE: SMA
FB1 FB2 FB4 FB6 = Electrosmith-Passives:FERRITE_BEAD: SMD EMI Suppression Ferrite Beads - excellent anti-EMI properties - low DCR - impedances till 3000 ohms - rated current up to 6 A
FD1-FD12 = Electrosmith-Connectors:FIDUCIAL: For use by pick and place machines to calibrate the vision/machine, 1mm By microbuilder.eu
HANDLE_1 HANDLE_2 SCREW_1-SCREW_10 = Electrosmith-Connectors:SCREW_TERMINAL
J1 = Electrosmith-Connectors:USB-C31-S-RA-CS2-SMT-BK-T/R: USB-C (USB TYPE-C) USB 3.1 (USB 3.1 Gen 2, Superspeed+) Receptacle Connector 24 Position Surface Mount, Right Angle; Through Hole; DESCRIPTION: USB-C (USB TYPE-C) USB 3.2 Gen 2 (USB 3.1 Gen 2, Superspeed + (USB 3.1)) Receptacle Connector 24 Position Surface Mount, Right Angle; Through Hole; DIGIKEY_PART_NUMBER: 2057-USB-C31-S-RA-CS2-SMT-BK-T/RTR-ND; MF: Adam Tech; MP: USB-C31-S-RA-CS2-SMT-BK-T/R; PACKAGE: None; PURCHASE-URL: https://pricing.snapeda.com/search?q=USB-C31-S-RA-CS2-SMT-BK-T/R&ref=eda
J_AUDIO_IN J_AUDIO_OUT J_HP_OUT J_MIDI_IN J_MIDI_OUT = Electrosmith-Connectors:SJ2_TRS_JACK: 3 conductors, 3.5mm, SMT Audio Jack w/ Tip Switch; AVAILABILITY: Unavailable; CUI_PURCHASE_URL: https://www.cui.com/product/interconnect/audio-connectors/jacks/3.5-mm-jacks/sj2-3586x-smt-series?utm_source=snapeda.com&utm_medium=referral&utm_campaign=snapedaBOM; DESCRIPTION: 3 conductors, 3.5mm, SMT Audio Jack w/ Tip Switch; MF: CUI Inc.; MP: SJ2-35863B1-SMT-TR; PACKAGE: None; PRICE: None
KEY1-KEY28 = Electrosmith-Interface:MX3A-L1NB
L2 L3 = Electrosmith-Passives:INDUCTOR; IPN: 3.3UH 1008 Inductor; MPN: AIML-1008HC-3R3M-T
L4 = Electrosmith-Passives:INDUCTOR
LED1 LED2 LED4 LED5 LED10 = Electrosmith-Interface:DIGITAL_LED; IPN: WS2812D-F8
LED3 LED6-LED9 = Electrosmith-Interface:DIGITAL_LED
LED_K2-LED_K9 LED_K12-LED_K28 = Electrosmith-Interface:DIGITAL_LED; IPN: Digital LED Reverse Mount
LED_PG1 LED_STAT1 = Electrosmith-Interface:LED; COLOR: RED; MPN: APT1608EC
MK1 = Electrosmith-Interface:MP23ABS1TR: 35Hz ~ 1.5kHz Analog Microphone MEMS (Silicon) Omnidirectional (-38dB ±1dB @ 94dB SPL) Solder Pads; DIGI-KEY_PART_NUMBER: 497-18092-2-ND; IPN: MP23ABS1TR; MF: STMicroelectronics; MPN: MP23ABS1TR
P2 P3 = Electrosmith-Connectors:ZIF-30
P4 = Electrosmith-Connectors:ZH_2
P5 = Electrosmith-Interface:MICRO_SD_CARD
R1-R5 R8-R121 R124-R129 R131-R137 R139-R142 R144-R162 = Electrosmith-Passives:R-US_: RESISTOR, American symbol; PACKAGE: R0603
R6 R7 R130 R138 R143 = Electrosmith-Passives:R-US_: RESISTOR, American symbol
S1 = Electrosmith-Interface:SWITCH_SPDT
SW1-SW6 = Electrosmith-Interface:ENCODER: ALPS rotary Encoder EC12E series with switch
SW7 = Electrosmith-Interface:SWITCH_DPDT: MPN: MSS6-V-T/R
SW_NORMAL = og-switch:S-ON-ON: On-on Switch
T1 = Electrosmith-Passives:THERMISTOR
TP1-TP4 TP12-TP20 = Electrosmith-Connectors:TP: Test pad
U1 = Electrosmith-Boards:ES_DAISY_SEED2_DFM_REV1
U2 U16 = Electrosmith-IC:MCP6004; BIN#: N/A; IPN: MCP6004 TSSOP-14; MPN: MCP6004T-E/ST; PACKAGE: TSSOP-14
U3 = Electrosmith-Power:ST1S03PUR; COPYRIGHT: Copyright (C) 2021 Ultra Librarian. All rights reserved.; IPN: ST1S03 DFN6D; MFR_NAME: STMicroelectronics; MPN: ST1S03PUR
U4 = Electrosmith-Power:LD1117; BIN#: 12-025; IPN: LD1117-5V; MPN: LD1117S50CTR; PACKAGE: SOT-223
U5 U7-U10 U14 = Electrosmith-IC:4021: 8-bit static SHIFT REGISTER; BIN#: 16-015; IPN: CD4021 SO-16; MPN: CD4021BM96; PACKAGE: SO-16
U6 = Electrosmith-IC:OPTOISOLATOR_H11L1M; MPN: H11L1SR2M
U11 = Electrosmith-Power:LMR62421XMFX/NOPB; COPYRIGHT: Copyright (C) 2023 Ultra Librarian. All rights reserved.; DIGIKEY_PART_NUMBER_1: 296-48595-1-ND; DIGIKEY_PART_NUMBER_2: 296-48595-2-ND; DIGIKEY_PART_NUMBER_3: 296-48595-6-ND; DIGIKEY_PART_NUMBER_4: LMR62421XMFX/NOPB-ND; MANUFACTURER_PART_NUMBER: LMR62421XMFX/NOPB; MFR_NAME: Texas Instruments
U12 = Electrosmith-IC:PCM3060PWR
U13 = Electrosmith-Power:MP2722_BUCK_CHARGER; IPN: MP2722 Buck Charger
U15 = Electrosmith-IC:USB3740B-AI9-TR; COPYRIGHT: Copyright (C) 2023 Ultra Librarian. All rights reserved.; DIGI-KEY_PART_NUMBER_1: USB3740B-AI9-TR-ND; DIGI-KEY_PART_NUMBER_2: USB3740B-AI9-TRCT-ND; DIGI-KEY_PART_NUMBER_3: USB3740B-AI9-TRDKR-ND; MANUFACTURER_PART_NUMBER: USB3740B-AI9-TR; MFR_NAME: Microchip
U17 = Electrosmith-IC:TPA6110
U$1 = Electrosmith-Power:LP346384

## Net classes
0 default: width 0.102 mm, drill 0.2 mm